# Altium project PC110.PrjPcb (part 2 of 5)

## Sheet PCMCIA.SchDoc
size 594 x 420 mm
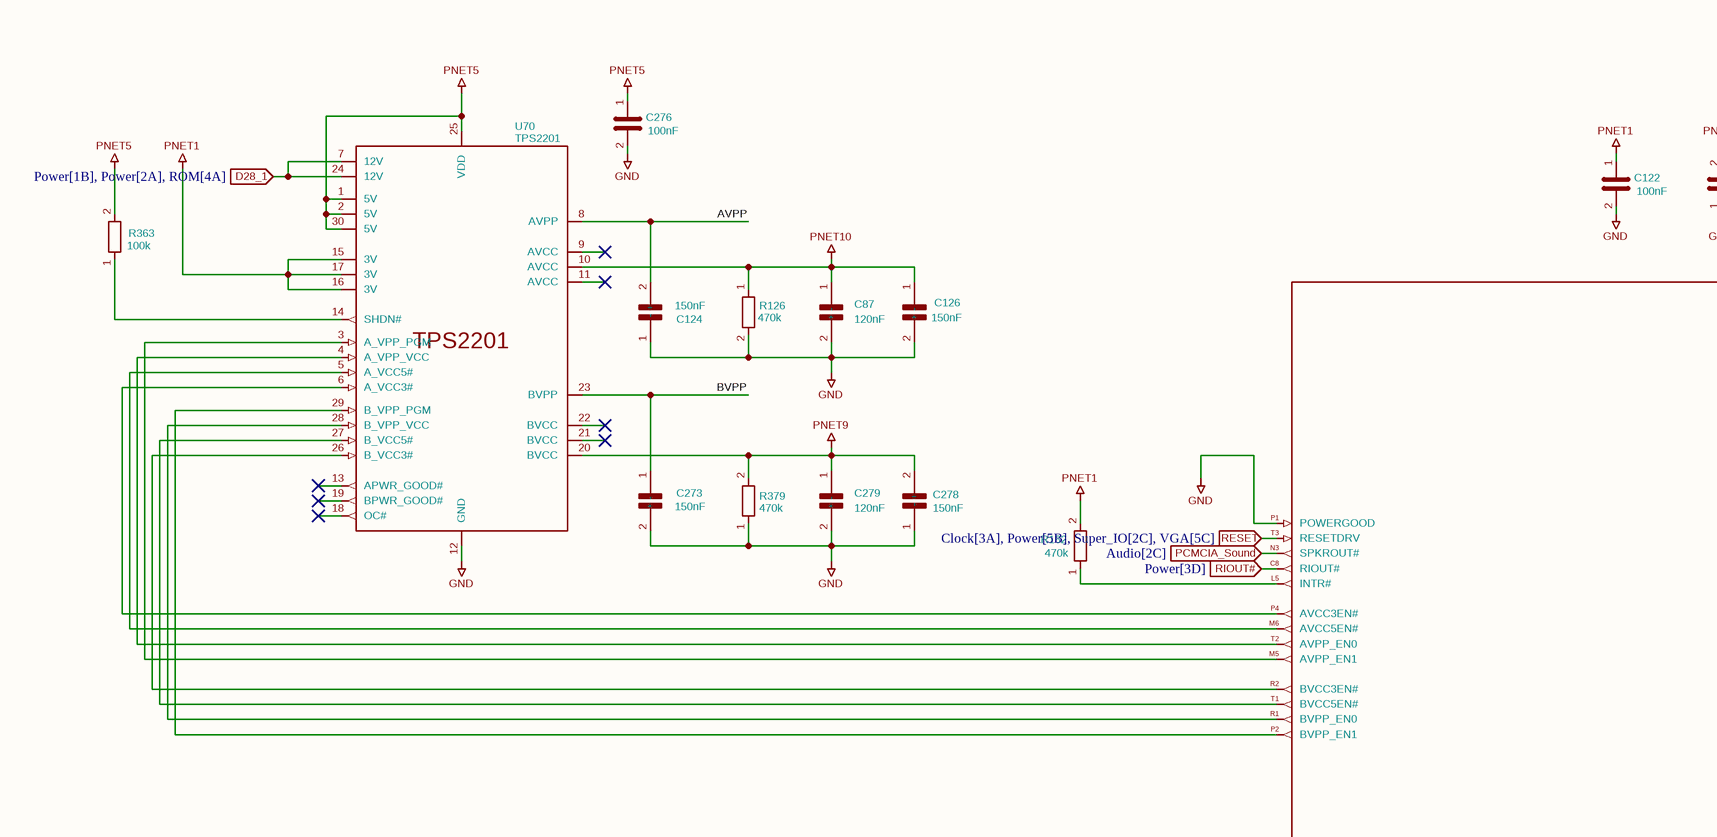
[diagram p9: PCMCIA.SchDoc, top left]
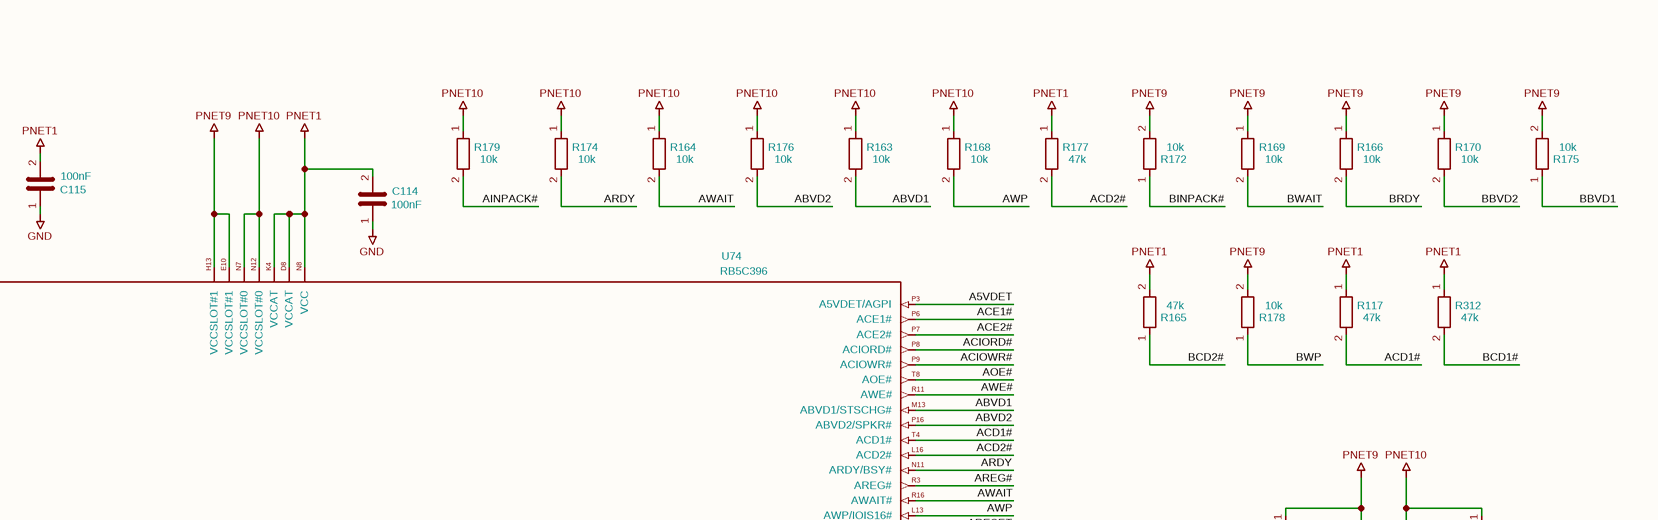
[diagram p10: PCMCIA.SchDoc, top right]
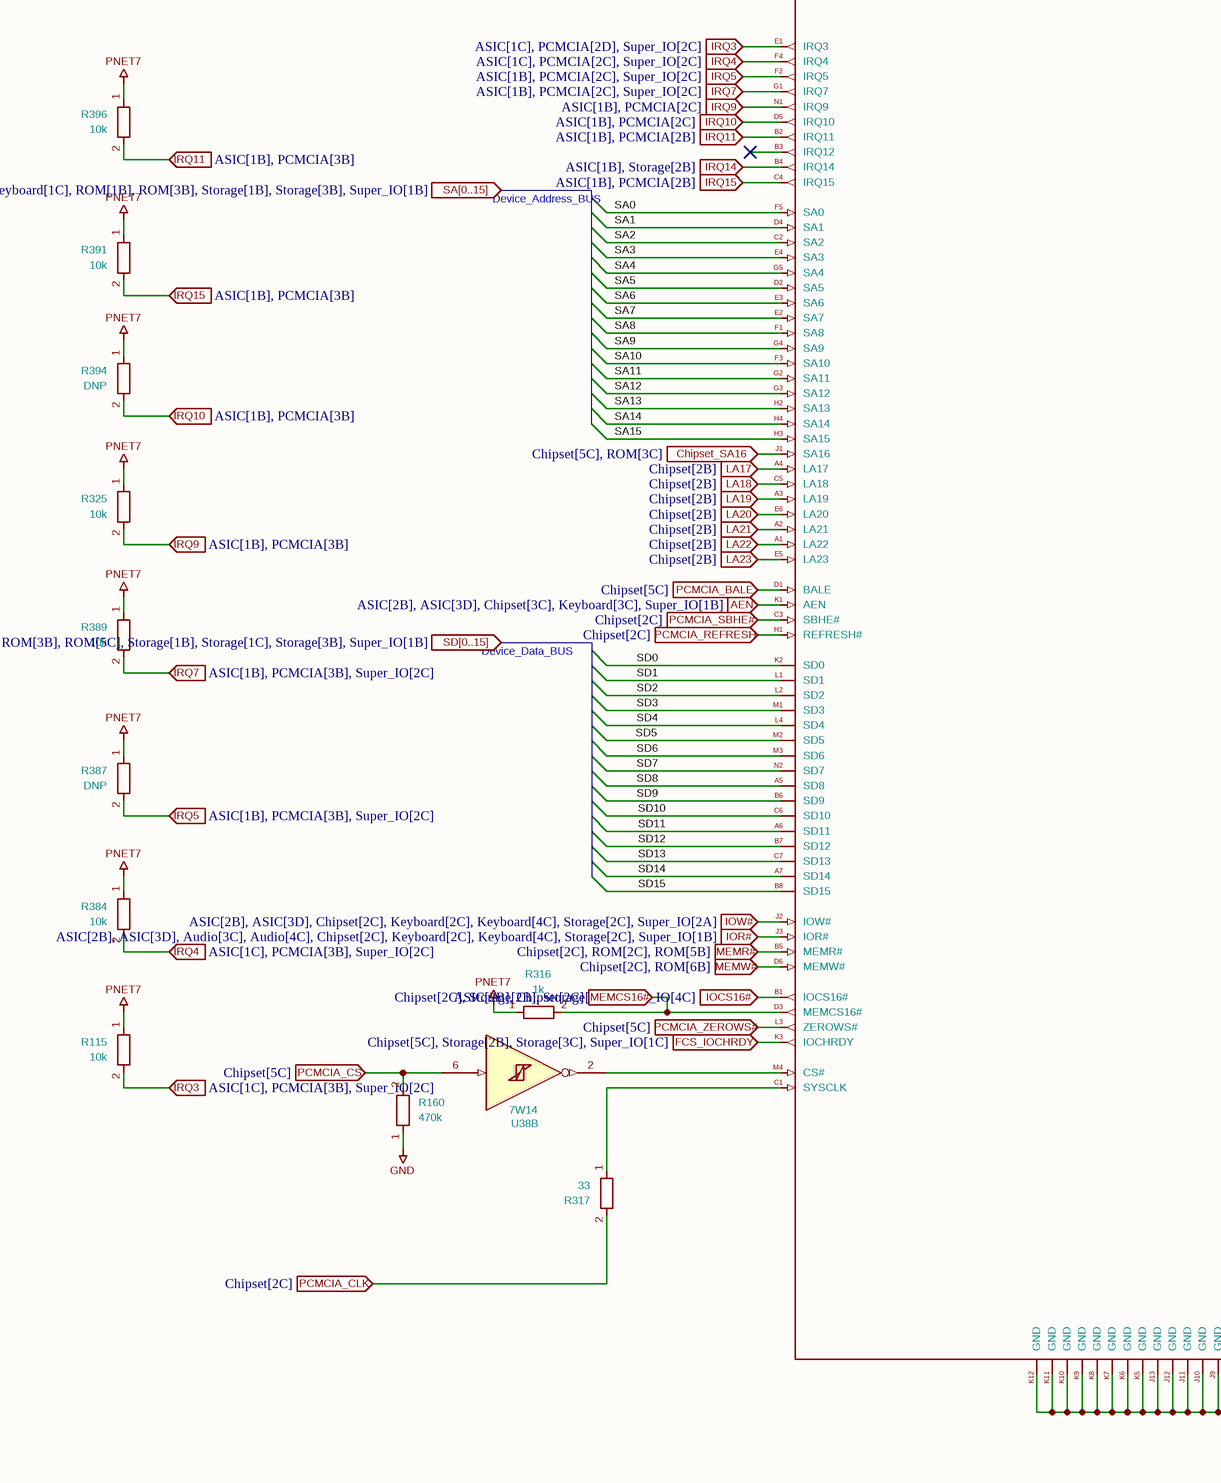
[diagram p11: PCMCIA.SchDoc, bottom left]
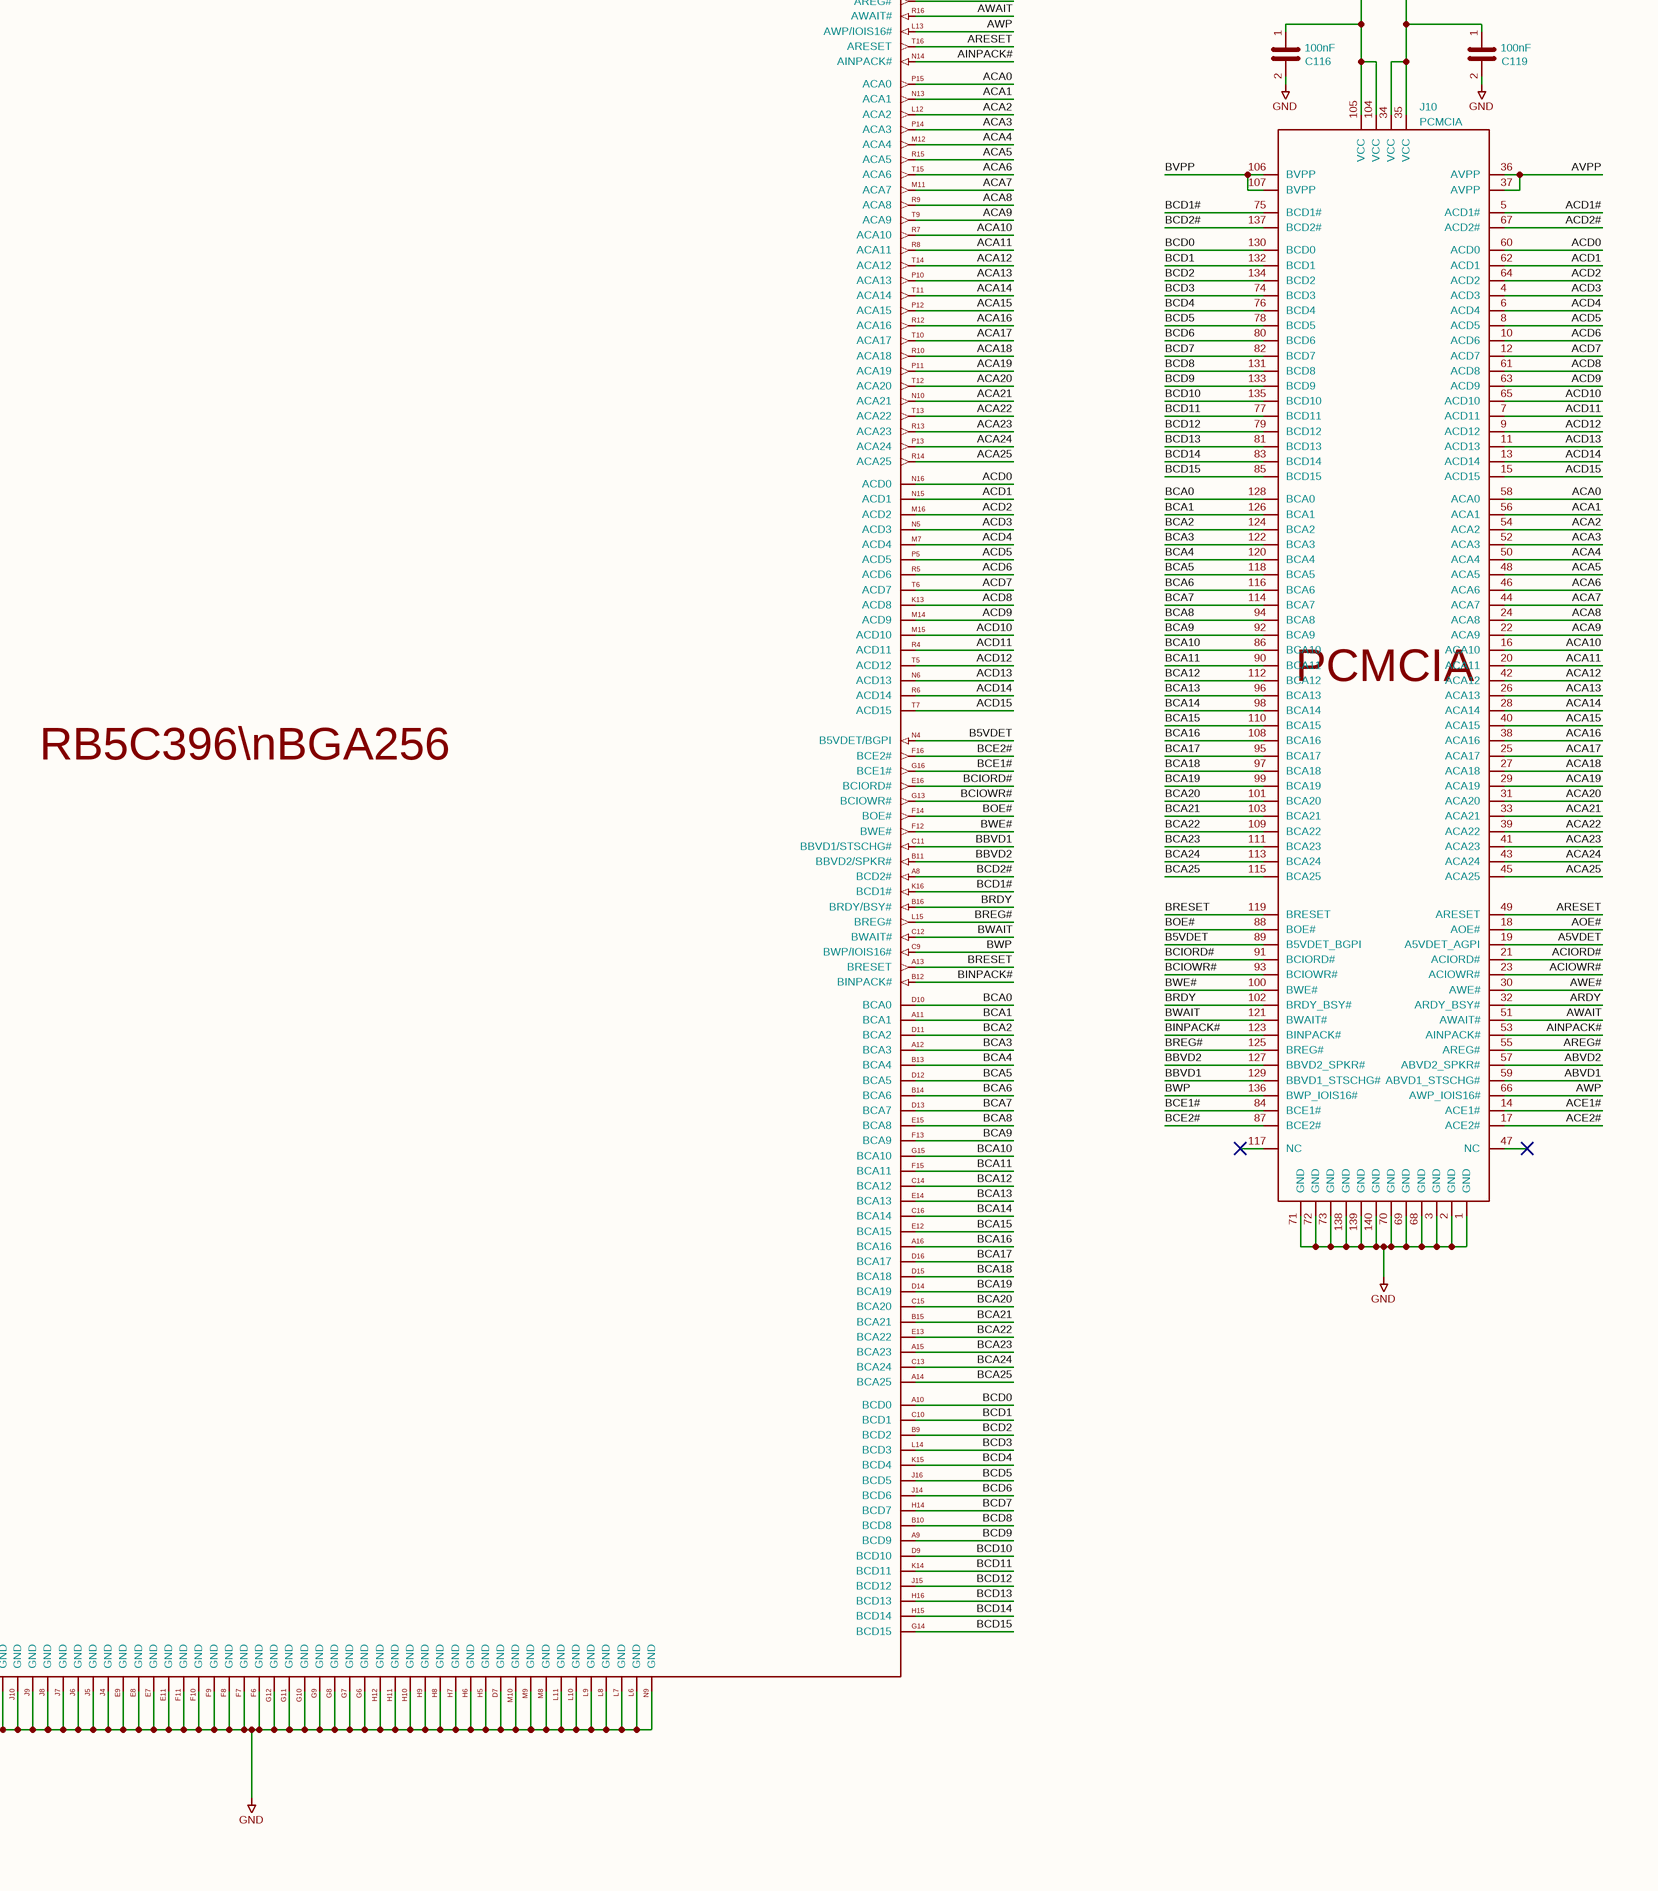
[diagram p12: PCMCIA.SchDoc, bottom right]

### Parts
C87  120nF  [C_0402_1005Metric]
C114  100nF  [C_0402_1005Metric]
C115  100nF  [C_0402_1005Metric]
C116  100nF  [C_0402_1005Metric]
C119  100nF  [C_0402_1005Metric]
C122  100nF  [C_0402_1005Metric]
C124  150nF  [C_0603_1608Metric]
C126  150nF  [C_0402_1005Metric]
C273  150nF  [C_0603_1608Metric]
C276  100nF  [C_0402_1005Metric]
C278  150nF  [C_0402_1005Metric]
C279  120nF  [C_0402_1005Metric]
J10  PCMCIA  [PCMCIA]
R115  10k  [R_0402_1005Metric]
R117  47k  [R_0402_1005Metric]
R126  470k  [R_0402_1005Metric]
R160  470k  [R_0402_1005Metric]
R162  470k  [R_0402_1005Metric]
R163  10k  [R_0402_1005Metric]
R164  10k  [R_0402_1005Metric]
R165  47k  [R_0402_1005Metric]
R166  10k  [R_0402_1005Metric]
R168  10k  [R_0402_1005Metric]
R169  10k  [R_0402_1005Metric]
R170  10k  [R_0402_1005Metric]
R172  10k  [R_0402_1005Metric]
R174  10k  [R_0402_1005Metric]
R175  10k  [R_0402_1005Metric]
R176  10k  [R_0402_1005Metric]
R177  47k  [R_0402_1005Metric]
R178  10k  [R_0402_1005Metric]
R179  10k  [R_0402_1005Metric]
R312  47k  [R_0402_1005Metric]
R316  1k  [R_0402_1005Metric]
R317  33  [R_0402_1005Metric]
R325  10k  [R_0402_1005Metric]
R363  100k  [R_0402_1005Metric]
R379  470k  [R_0402_1005Metric]
R384  10k  [R_0402_1005Metric]
R387  DNP  [R_0402_1005Metric]
R389  10k  [R_0402_1005Metric]
R391  10k  [R_0402_1005Metric]
R394  DNP  [R_0402_1005Metric]
R396  10k  [R_0402_1005Metric]
U38  7W14  [sso-8]  (part B of 4)
U70  TPS2201  [TSSOP-30_6.1x9.7mm_P0.65mm]
U74  RB5C396  [BGA-256]

### Ports
AEN (in, see ASIC[2B], ASIC[3D], Chipset[3C], Keyboard[3C], Super_IO[1B]), Chipset_SA16 (in, see Chipset[5C], ROM[3C]), D28_1 (in, see Power[1B], Power[2A], ROM[4A]), FCS_IOCHRDY (in, see Chipset[5C], Storage[2B], Storage[3C], Super_IO[1C]), IOCS16# (in, see Chipset[2C], Storage[2B], Storage[4B], Super_IO[4C]), IOR# (in, see ASIC[2B], ASIC[3D], Audio[3C], Audio[4C], Chipset[2C], Keyboard[2C], Keyboard[4C], Storage[2C], Super_IO[1B]), IOW# (in, see ASIC[2B], ASIC[3D], Chipset[2C], Keyboard[2C], Keyboard[4C], Storage[2C], Super_IO[2A]), IRQ3 (in, see ASIC[1C], PCMCIA[2D], Super_IO[2C]), IRQ3 (in, see ASIC[1C], PCMCIA[3B], Super_IO[2C]), IRQ4 (in, see ASIC[1C], PCMCIA[2C], Super_IO[2C]), IRQ4 (in, see ASIC[1C], PCMCIA[3B], Super_IO[2C]), IRQ5 (in, see ASIC[1B], PCMCIA[2C], Super_IO[2C]), IRQ5 (in, see ASIC[1B], PCMCIA[3B], Super_IO[2C]), IRQ7 (in, see ASIC[1B], PCMCIA[2C], Super_IO[2C]), IRQ7 (in, see ASIC[1B], PCMCIA[3B], Super_IO[2C]), IRQ9 (in, see ASIC[1B], PCMCIA[2C]), IRQ9 (in, see ASIC[1B], PCMCIA[3B]), IRQ10 (in, see ASIC[1B], PCMCIA[2C]), IRQ10 (in, see ASIC[1B], PCMCIA[3B]), IRQ11 (in, see ASIC[1B], PCMCIA[2B]), IRQ11 (in, see ASIC[1B], PCMCIA[3B]), IRQ14 (in, see ASIC[1B], Storage[2B]), IRQ15 (in, see ASIC[1B], PCMCIA[2B]), IRQ15 (in, see ASIC[1B], PCMCIA[3B]), LA17 (in, see Chipset[2B]), LA18 (in, see Chipset[2B]), LA19 (in, see Chipset[2B]), LA20 (in, see Chipset[2B]), LA21 (in, see Chipset[2B]), LA22 (in, see Chipset[2B]), LA23 (in, see Chipset[2B]), MEMCS16# (in, see ASIC[2B], Chipset[2C]), MEMR# (in, see Chipset[2C], ROM[2C], ROM[5B]), MEMW# (in, see Chipset[2C], ROM[6B]), PCMCIA_BALE (in, see Chipset[5C]), PCMCIA_CLK (in, see Chipset[2C]), PCMCIA_CS (in, see Chipset[5C]), PCMCIA_REFRESH (in, see Chipset[2C]), PCMCIA_SBHE# (in, see Chipset[2C]), PCMCIA_Sound (in, see Audio[2C]), PCMCIA_ZEROWS# (in, see Chipset[5C]), RESET (in, see Clock[3A], Power[5B], Super_IO[2C], VGA[5C]), RIOUT# (in, see Power[3D]), SA[0..15] (in, see ASIC[1B], ASIC[3D], Audio[4B], Chipset[2D], Chipset[6B], Keyboard[1C], ROM[1B], ROM[3B], Storage[1B], Storage[3B], Super_IO[1B]), SD[0..15] (in, see ASIC[1B], ASIC[3C], Audio[3B], Chipset[2B], Keyboard[1C], ROM[3B], ROM[5C], Storage[1B], Storage[1C], Storage[3B], Super_IO[1B])

### Nets
GND: C87.2(-) C114.1 C115.1 C116.2 C119.2 C122.2 C124.1(+) C126.2(-) C273.2(-) C276.2 C278.1(+) C279.2(-) J10.1(GND) J10.2(GND) J10.3(GND) J10.68(GND) J10.69(GND) J10.70(GND) J10.71(GND) J10.72(GND) J10.73(GND) J10.138(GND) J10.139(GND) J10.140(GND) R126.2 R160.1 R379.1 U70.12(GND) U74.D7(GND) U74.E7(GND) U74.E8(GND) U74.E9(GND) U74.E11(GND) U74.F6(GND) U74.F7(GND) U74.F8(GND) U74.F9(GND) U74.F10(GND) U74.F11(GND) U74.G6(GND) U74.G7(GND) U74.G8(GND) U74.G9(GND) U74.G10(GND) U74.G11(GND) U74.G12(GND) U74.H5(GND) U74.H6(GND) U74.H7(GND) U74.H8(GND) U74.H9(GND) U74.H10(GND) U74.H11(GND) U74.H12(GND) U74.J4(GND) U74.J5(GND) U74.J6(GND) U74.J7(GND) U74.J8(GND) U74.J9(GND) U74.J10(GND) U74.J11(GND) U74.J12(GND) U74.J13(GND) U74.K5(GND) U74.K6(GND) U74.K7(GND) U74.K8(GND) U74.K9(GND) U74.K10(GND) U74.K11(GND) U74.K12(GND) U74.L6(GND) U74.L7(GND) U74.L8(GND) U74.L9(GND) U74.L10(GND) U74.L11(GND) U74.M8(GND) U74.M9(GND) U74.M10(GND) U74.N9(GND) U74.P1(POWERGOOD)
PNET1: C114.2 C115.2 C122.1 R117.1 R162.2 R165.2 R177.1 R312.1 U70.15(3V) U70.16(3V) U70.17(3V) U74.D8(VCCAT) U74.K4(VCCAT) U74.N8(VCC)
PNET5: C276.1 R363.2 U70.1(5V) U70.2(5V) U70.25(VDD) U70.30(5V)
PNET7: R115.1 R316.1 R325.1 R384.1 R387.1 R389.1 R391.1 R394.1 R396.1
PNET9: C116.1 C278.2(-) C279.1(+) J10.104(VCC) J10.105(VCC) R166.1 R169.1 R170.1 R172.2 R175.2 R178.2 R379.2 U70.20(BVCC) U74.E10(VCCSLOT#1) U74.H13(VCCSLOT#1)
PNET10: C87.1(+) C119.1 C126.1(+) J10.34(VCC) J10.35(VCC) R126.1 R163.1 R164.1 R168.1 R174.1 R176.1 R179.1 U70.10(AVCC) U74.N7(VCCSLOT#0) U74.N12(VCCSLOT#0)
A5VDET: J10.19(A5VDET_AGPI) U74.P3(A5VDET/AGPI)
ABVD1: J10.59(ABVD1_STSCHG#) R163.2 U74.M13(ABVD1/STSCHG#)
ABVD2: J10.57(ABVD2_SPKR#) R176.2 U74.P16(ABVD2/SPKR#)
ACA0: J10.58(ACA0) U74.P15(ACA0)
ACA1: J10.56(ACA1) U74.N13(ACA1)
ACA2: J10.54(ACA2) U74.L12(ACA2)
ACA3: J10.52(ACA3) U74.P14(ACA3)
ACA4: J10.50(ACA4) U74.M12(ACA4)
ACA5: J10.48(ACA5) U74.R15(ACA5)
ACA6: J10.46(ACA6) U74.T15(ACA6)
ACA7: J10.44(ACA7) U74.M11(ACA7)
ACA8: J10.24(ACA8) U74.R9(ACA8)
ACA9: J10.22(ACA9) U74.T9(ACA9)
ACA10: J10.16(ACA10) U74.R7(ACA10)
ACA11: J10.20(ACA11) U74.R8(ACA11)
ACA12: J10.42(ACA12) U74.T14(ACA12)
ACA13: J10.26(ACA13) U74.P10(ACA13)
ACA14: J10.28(ACA14) U74.T11(ACA14)
ACA15: J10.40(ACA15) U74.P12(ACA15)
ACA16: J10.38(ACA16) U74.R12(ACA16)
ACA17: J10.25(ACA17) U74.T10(ACA17)
ACA18: J10.27(ACA18) U74.R10(ACA18)
ACA19: J10.29(ACA19) U74.P11(ACA19)
ACA20: J10.31(ACA20) U74.T12(ACA20)
ACA21: J10.33(ACA21) U74.N10(ACA21)
ACA22: J10.39(ACA22) U74.T13(ACA22)
ACA23: J10.41(ACA23) U74.R13(ACA23)
ACA24: J10.43(ACA24) U74.P13(ACA24)
ACA25: J10.45(ACA25) U74.R14(ACA25)
ACD0: J10.60(ACD0) U74.N16(ACD0)
ACD1: J10.62(ACD1) U74.N15(ACD1)
ACD1#: J10.5(ACD1#) R117.2 U74.T4(ACD1#)
ACD2: J10.64(ACD2) U74.M16(ACD2)
ACD2#: J10.67(ACD2#) R177.2 U74.L16(ACD2#)
ACD3: J10.4(ACD3) U74.N5(ACD3)
ACD4: J10.6(ACD4) U74.M7(ACD4)
ACD5: J10.8(ACD5) U74.P5(ACD5)
ACD6: J10.10(ACD6) U74.R5(ACD6)
ACD7: J10.12(ACD7) U74.T6(ACD7)
ACD8: J10.61(ACD8) U74.K13(ACD8)
ACD9: J10.63(ACD9) U74.M14(ACD9)
ACD10: J10.65(ACD10) U74.M15(ACD10)
ACD11: J10.7(ACD11) U74.R4(ACD11)
ACD12: J10.9(ACD12) U74.T5(ACD12)
ACD13: J10.11(ACD13) U74.N6(ACD13)
ACD14: J10.13(ACD14) U74.R6(ACD14)
ACD15: J10.15(ACD15) U74.T7(ACD15)
ACE1#: J10.14(ACE1#) U74.P6(ACE1#)
ACE2#: J10.17(ACE2#) U74.P7(ACE2#)
ACIORD#: J10.21(ACIORD#) U74.P8(ACIORD#)
ACIOWR#: J10.23(ACIOWR#) U74.P9(ACIOWR#)
AEN: U74.K1(AEN) ; port AEN
AINPACK#: J10.53(AINPACK#) R179.2 U74.N14(AINPACK#)
AOE#: J10.18(AOE#) U74.T8(AOE#)
ARDY: J10.32(ARDY_BSY#) R174.2 U74.N11(ARDY/BSY#)
AREG#: J10.55(AREG#) U74.R3(AREG#)
ARESET: J10.49(ARESET) U74.T16(ARESET)
AVPP: C124.2(-) J10.36(AVPP) J10.37(AVPP) U70.8(AVPP)
AWAIT: J10.51(AWAIT#) R164.2 U74.R16(AWAIT#)
AWE#: J10.30(AWE#) U74.R11(AWE#)
AWP: J10.66(AWP_IOIS16#) R168.2 U74.L13(AWP/IOIS16#)
B5VDET: J10.89(B5VDET_BGPI) U74.N4(B5VDET/BGPI)
BBVD1: J10.129(BBVD1_STSCHG#) R175.1 U74.C11(BBVD1/STSCHG#)
BBVD2: J10.127(BBVD2_SPKR#) R170.2 U74.B11(BBVD2/SPKR#)
BCA0: J10.128(BCA0) U74.D10(BCA0)
BCA1: J10.126(BCA1) U74.A11(BCA1)
BCA2: J10.124(BCA2) U74.D11(BCA2)
BCA3: J10.122(BCA3) U74.A12(BCA3)
BCA4: J10.120(BCA4) U74.B13(BCA4)
BCA5: J10.118(BCA5) U74.D12(BCA5)
BCA6: J10.116(BCA6) U74.B14(BCA6)
BCA7: J10.114(BCA7) U74.D13(BCA7)
BCA8: J10.94(BCA8) U74.E15(BCA8)
BCA9: J10.92(BCA9) U74.F13(BCA9)
BCA10: J10.86(BCA10) U74.G15(BCA10)
BCA11: J10.90(BCA11) U74.F15(BCA11)
BCA12: J10.112(BCA12) U74.C14(BCA12)
BCA13: J10.96(BCA13) U74.E14(BCA13)
BCA14: J10.98(BCA14) U74.C16(BCA14)
BCA15: J10.110(BCA15) U74.E12(BCA15)
BCA16: J10.108(BCA16) U74.A16(BCA16)
BCA17: J10.95(BCA17) U74.D16(BCA17)
BCA18: J10.97(BCA18) U74.D15(BCA18)
BCA19: J10.99(BCA19) U74.D14(BCA19)
BCA20: J10.101(BCA20) U74.C15(BCA20)
BCA21: J10.103(BCA21) U74.B15(BCA21)
BCA22: J10.109(BCA22) U74.E13(BCA22)
BCA23: J10.111(BCA23) U74.A15(BCA23)
BCA24: J10.113(BCA24) U74.C13(BCA24)
BCA25: J10.115(BCA25) U74.A14(BCA25)
BCD0: J10.130(BCD0) U74.A10(BCD0)
BCD1: J10.132(BCD1) U74.C10(BCD1)
BCD1#: J10.75(BCD1#) R312.2 U74.K16(BCD1#)
BCD2: J10.134(BCD2) U74.B9(BCD2)
BCD2#: J10.137(BCD2#) R165.1 U74.A8(BCD2#)
BCD3: J10.74(BCD3) U74.L14(BCD3)
BCD4: J10.76(BCD4) U74.K15(BCD4)
BCD5: J10.78(BCD5) U74.J16(BCD5)
BCD6: J10.80(BCD6) U74.J14(BCD6)
BCD7: J10.82(BCD7) U74.H14(BCD7)
BCD8: J10.131(BCD8) U74.B10(BCD8)
BCD9: J10.133(BCD9) U74.A9(BCD9)
BCD10: J10.135(BCD10) U74.D9(BCD10)
BCD11: J10.77(BCD11) U74.K14(BCD11)
BCD12: J10.79(BCD12) U74.J15(BCD12)
BCD13: J10.81(BCD13) U74.H16(BCD13)
BCD14: J10.83(BCD14) U74.H15(BCD14)
BCD15: J10.85(BCD15) U74.G14(BCD15)
BCE1#: J10.84(BCE1#) U74.G16(BCE1#)
BCE2#: J10.87(BCE2#) U74.F16(BCE2#)
BCIORD#: J10.91(BCIORD#) U74.E16(BCIORD#)
BCIOWR#: J10.93(BCIOWR#) U74.G13(BCIOWR#)
BINPACK#: J10.123(BINPACK#) R172.1 U74.B12(BINPACK#)
BOE#: J10.88(BOE#) U74.F14(BOE#)
BRDY: J10.102(BRDY_BSY#) R166.2 U74.B16(BRDY/BSY#)
BREG#: J10.125(BREG#) U74.L15(BREG#)
BRESET: J10.119(BRESET) U74.A13(BRESET)
BVPP: C273.1(+) J10.106(BVPP) J10.107(BVPP) U70.23(BVPP)
BWAIT: J10.121(BWAIT#) R169.2 U74.C12(BWAIT#)
BWE#: J10.100(BWE#) U74.F12(BWE#)
BWP: J10.136(BWP_IOIS16#) R178.1 U74.C9(BWP/IOIS16#)
Chipset_SA16: U74.J1(SA16) ; port Chipset_SA16
D28_1: U70.7(12V) U70.24(12V) ; port D28_1
FCS_IOCHRDY: U74.K3(IOCHRDY) ; port FCS_IOCHRDY
IOCS16#: U74.B1(IOCS16#) ; port IOCS16#
IOR#: U74.J3(IOR#) ; port IOR#
IOW#: U74.J2(IOW#) ; port IOW#
IRQ3: R115.2 U74.E1(IRQ3) ; port IRQ3
IRQ4: R384.2 U74.F4(IRQ4) ; port IRQ4
IRQ5: R387.2 U74.F2(IRQ5) ; port IRQ5
IRQ7: R389.2 U74.G1(IRQ7) ; port IRQ7
IRQ9: R325.2 U74.N1(IRQ9) ; port IRQ9
IRQ10: R394.2 U74.D5(IRQ10) ; port IRQ10
IRQ11: R396.2 U74.B2(IRQ11) ; port IRQ11
IRQ14: U74.B4(IRQ14) ; port IRQ14
IRQ15: R391.2 U74.C4(IRQ15) ; port IRQ15
LA17: U74.A4(LA17) ; port LA17
LA18: U74.C5(LA18) ; port LA18
LA19: U74.A3(LA19) ; port LA19
LA20: U74.E6(LA20) ; port LA20
LA21: U74.A2(LA21) ; port LA21
LA22: U74.A1(LA22) ; port LA22
LA23: U74.E5(LA23) ; port LA23
MEMCS16#: R316.2 U74.D3(MEMCS16#) ; port MEMCS16#
MEMR#: U74.B5(MEMR#) ; port MEMR#
MEMW#: U74.D6(MEMW#) ; port MEMW#
PCMCIA_BALE: U74.D1(BALE) ; port PCMCIA_BALE
PCMCIA_CLK: R317.2 ; port PCMCIA_CLK
PCMCIA_CS: R160.2 U38.6 ; port PCMCIA_CS
PCMCIA_REFRESH: U74.H1(REFRESH#) ; port PCMCIA_REFRESH
PCMCIA_SBHE#: U74.C3(SBHE#) ; port PCMCIA_SBHE#
PCMCIA_Sound: U74.N3(SPKROUT#) ; port PCMCIA_Sound
PCMCIA_ZEROWS#: U74.L3(ZEROWS#) ; port PCMCIA_ZEROWS#
RESET: U74.T3(RESETDRV) ; port RESET
RIOUT#: U74.C8(RIOUT#) ; port RIOUT#
SA0: U74.F5(SA0)
SA1: U74.D4(SA1)
SA2: U74.C2(SA2)
SA3: U74.E4(SA3)
SA4: U74.G5(SA4)
SA5: U74.D2(SA5)
SA6: U74.E3(SA6)
SA7: U74.E2(SA7)
SA8: U74.F1(SA8)
SA9: U74.G4(SA9)
SA10: U74.F3(SA10)
SA11: U74.G2(SA11)
SA12: U74.G3(SA12)
SA13: U74.H2(SA13)
SA14: U74.H4(SA14)
SA15: U74.H3(SA15)
SD0: U74.K2(SD0)
SD1: U74.L1(SD1)
SD2: U74.L2(SD2)
SD3: U74.M1(SD3)
SD4: U74.L4(SD4)
SD5: U74.M2(SD5)
SD6: U74.M3(SD6)
SD7: U74.N2(SD7)
SD8: U74.A5(SD8)
SD9: U74.B6(SD9)
SD10: U74.C6(SD10)
SD11: U74.A6(SD11)
SD12: U74.B7(SD12)
SD13: U74.C7(SD13)
SD14: U74.A7(SD14)
SD15: U74.B8(SD15)
NetR162_1: R162.1 U74.L5(INTR#)
NetR317_1: R317.1 U74.C1(SYSCLK)
NetR363_1: R363.1 U70.14(SHDN#)
NetU38_2: U38.2 U74.M4(CS#)
NetU70_3: U70.3(A_VPP_PGM) U74.M5(AVPP_EN1)
NetU70_4: U70.4(A_VPP_VCC) U74.T2(AVPP_EN0)
NetU70_5: U70.5(A_VCC5#) U74.M6(AVCC5EN#)
NetU70_6: U70.6(A_VCC3#) U74.P4(AVCC3EN#)
NetU70_26: U70.26(B_VCC3#) U74.R2(BVCC3EN#)
NetU70_27: U70.27(B_VCC5#) U74.T1(BVCC5EN#)
NetU70_28: U70.28(B_VPP_VCC) U74.R1(BVPP_EN0)
NetU70_29: U70.29(B_VPP_PGM) U74.P2(BVPP_EN1)

Not connected (* = marked no-connect by the designer): J10 47(NC)* 117(NC)*; U70 9(AVCC)* 11(AVCC)* 13(APWR_GOOD#)* 18(OC#)* 19(BPWR_GOOD#)* 21(BVCC)* 22(BVCC)*; U74 B3(IRQ12)*

### Notes on the sheet
- Device_Address_BUS
- Device_Data_BUS
- 1
- 2
- 3
- 4
- 5
- 6
- 7
- 8
- 9
- 10
- 11
- A
- B
- C
- D
- E
- F
- G
- H
- Title: PC110
- File: PCMCIA.kicad_sch
- Sheet: /
- Recreated by: Ahmad Byagowi
- KiCad E.D.A.  kicad (5.1.4)-1
- Size: A2
- Date:
- Rev:
- Id: 1/1
- (in symbol RB5C396) RB5C396\nBGA256

### Library data of the parts
C87 C114-C116 C119 C122 C124 C126 C273 C276 C278 C279 = C
  C87 C279: Value: 120nF; Footprint: Capacitor_SMD:C_0402_1005Metric
  C114-C116 C119 C122 C276: Value: 100nF; Footprint: Capacitor_SMD:C_0402_1005Metric
  C124 C273: Value: 150nF; Footprint: Capacitor_SMD:C_0603_1608Metric
  C126 C278: Value: 150nF; Footprint: Capacitor_SMD:C_0402_1005Metric
J10 = PCMCIA_Conn: Value: PCMCIA; Footprint: PC110:PCMCIA
R115 R117 R126 R160 R162-R166 R168-R170 R172 R174-R179 R312 R316 R317 R325 R363 R379 R384 R387 R389 R391 R394 R396 = R
  R115 R163 R164 R166 R168-R170 R172 R174-R176 R178 R179: Value: 10k; Footprint: PCM_Resistor_SMD_AKL:R_0402_1005Metric
  R117 R165 R177: Value: 47k; Footprint: PCM_Resistor_SMD_AKL:R_0402_1005Metric
  R126 R160 R162: Value: 470k; Footprint: PCM_Resistor_SMD_AKL:R_0402_1005Metric
  R312: Value: 47k; Footprint: Resistor_SMD:R_0402_1005Metric
  R316: Value: 1k; Footprint: PCM_Resistor_SMD_AKL:R_0402_1005Metric
  R317: Value: 33; Footprint: PCM_Resistor_SMD_AKL:R_0402_1005Metric
  R325 R384 R389 R391 R396: Value: 10k; Footprint: Resistor_SMD:R_0402_1005Metric
  R363: Value: 100k; Footprint: Resistor_SMD:R_0402_1005Metric
  R379: Value: 470k; Footprint: Resistor_SMD:R_0402_1005Metric
  R387 R394: Value: DNP; Footprint: Resistor_SMD:R_0402_1005Metric
U38 = 74LVC3G14: Value: 7W14; Footprint: PC110:sso-8
U70 = TPS2201: Value: TPS2201; Footprint: Package_SO:TSSOP-30_6.1x9.7mm_P0.65mm
U74 = RB5C396: Value: RB5C396; Footprint: PC110:BGA-256

## Sheet Memory.SchDoc
size 420 x 297 mm
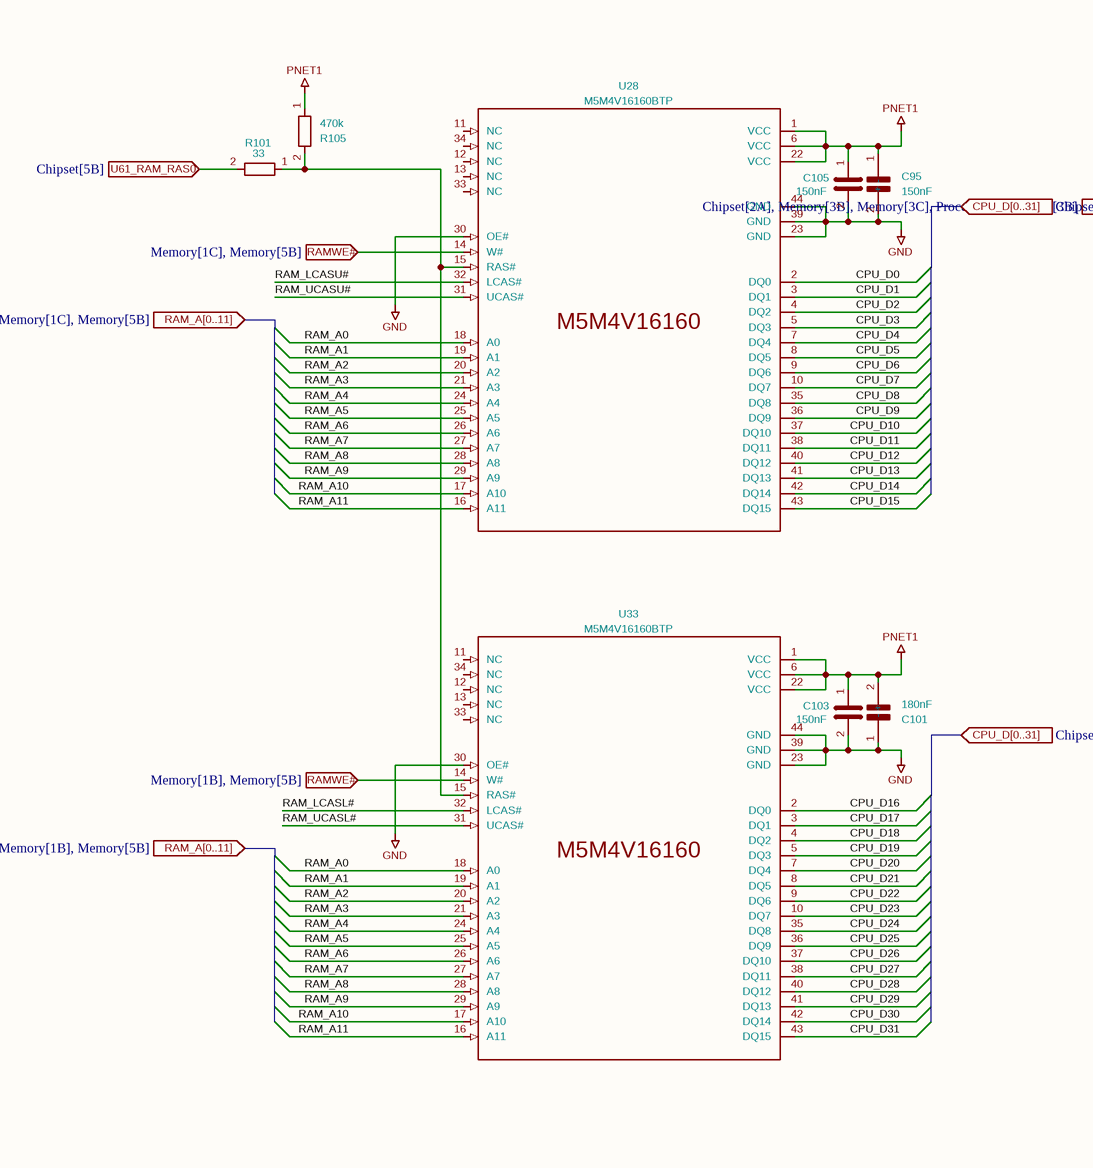
[diagram p13: Memory.SchDoc, left]
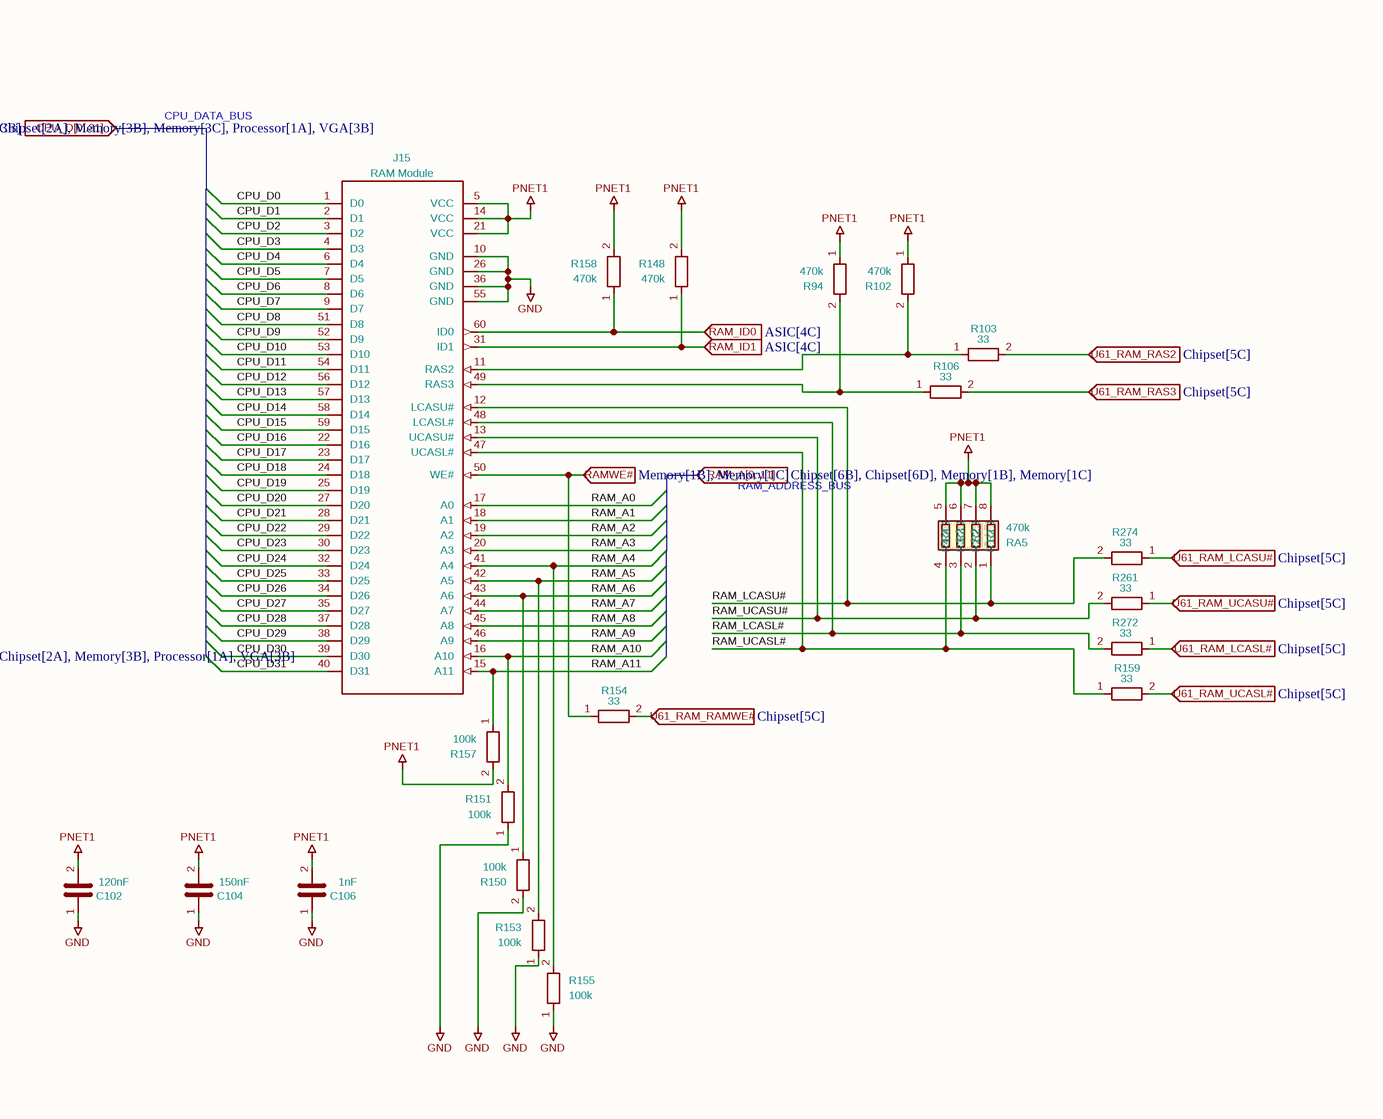
[diagram p14: Memory.SchDoc, right]

### Parts
C95  150nF  [C_0402_1005Metric]
C101  180nF  [C_0402_1005Metric]
C102  120nF  [C_0402_1005Metric]
C103  150nF  [C_0402_1005Metric]
C104  150nF  [C_0402_1005Metric]
C105  150nF  [C_0402_1005Metric]
C106  1nF  [C_0402_1005Metric]
J15  RAM Module  [RAM Module]
R94  470k  [R_0402_1005Metric]
R101  33  [R_0402_1005Metric]
R102  470k  [R_0402_1005Metric]
R103  33  [R_0402_1005Metric]
R105  470k  [R_0402_1005Metric]
R106  33  [R_0402_1005Metric]
R148  470k  [R_0402_1005Metric]
R150  100k  [R_0402_1005Metric]
R151  100k  [R_0402_1005Metric]
R153  100k  [R_0402_1005Metric]
R154  33  [R_0402_1005Metric]
R155  100k  [R_0402_1005Metric]
R157  100k  [R_0402_1005Metric]
R158  470k  [R_0402_1005Metric]
R159  33  [R_0402_1005Metric]
R261  33  [R_0402_1005Metric]
R272  33  [R_0402_1005Metric]
R274  33  [R_0402_1005Metric]
RA5  470k  [R-array]
U28  M5M4V16160BTP  [RAMchip]
U33  M5M4V16160BTP  [RAMchip]

### Ports
CPU_D[0..31] (in, see Chipset[2A], Memory[3B], Memory[3C], Processor[1A], VGA[3B]), CPU_D[0..31] (in, see Chipset[2A], Memory[3B], Processor[1A], VGA[3B]), RAM_A[0..11] (in, see Chipset[6B], Chipset[6D], Memory[1B], Memory[1C]), RAM_A[0..11] (in, see Chipset[6B], Chipset[6D], Memory[1B], Memory[5B]), RAM_A[0..11] (in, see Chipset[6B], Chipset[6D], Memory[1C], Memory[5B]), RAM_ID0 (in, see ASIC[4C]), RAM_ID1 (in, see ASIC[4C]), RAMWE# (in, see Memory[1B], Memory[1C]), RAMWE# (in, see Memory[1B], Memory[5B]), RAMWE# (in, see Memory[1C], Memory[5B]), U61_RAM_LCASL# (in, see Chipset[5C]), U61_RAM_LCASU# (in, see Chipset[5C]), U61_RAM_RAMWE# (in, see Chipset[5C]), U61_RAM_RAS0 (in, see Chipset[5B]), U61_RAM_RAS2 (in, see Chipset[5C]), U61_RAM_RAS3 (in, see Chipset[5C]), U61_RAM_UCASL# (in, see Chipset[5C]), U61_RAM_UCASU# (in, see Chipset[5C])

### Nets
GND: C95.2(-) C101.1(+) C102.1 C103.2 C104.1 C105.2 C106.1 J15.10(GND) J15.26(GND) J15.36(GND) J15.55(GND) R150.2 R151.1 R153.1 R155.1 U28.23(GND) U28.30(OE#) U28.39(GND) U28.44(GND) U33.23(GND) U33.30(OE#) U33.39(GND) U33.44(GND)
PNET1: C95.1(+) C101.2(-) C102.2 C103.1 C104.2 C105.1 C106.2 J15.5(VCC) J15.14(VCC) J15.21(VCC) R94.1 R102.1 R105.1 R148.2 R157.2 R158.2 RA5.5(R4.2) RA5.6(R3.2) RA5.7(R2.2) RA5.8(R1.2) U28.1(VCC) U28.6(VCC) U28.22(VCC) U33.1(VCC) U33.6(VCC) U33.22(VCC)
CPU_D0: J15.1(D0) U28.2(DQ0)
CPU_D1: J15.2(D1) U28.3(DQ1)
CPU_D2: J15.3(D2) U28.4(DQ2)
CPU_D3: J15.4(D3) U28.5(DQ3)
CPU_D4: J15.6(D4) U28.7(DQ4)
CPU_D5: J15.7(D5) U28.8(DQ5)
CPU_D6: J15.8(D6) U28.9(DQ6)
CPU_D7: J15.9(D7) U28.10(DQ7)
CPU_D8: J15.51(D8) U28.35(DQ8)
CPU_D9: J15.52(D9) U28.36(DQ9)
CPU_D10: J15.53(D10) U28.37(DQ10)
CPU_D11: J15.54(D11) U28.38(DQ11)
CPU_D12: J15.56(D12) U28.40(DQ12)
CPU_D13: J15.57(D13) U28.41(DQ13)
CPU_D14: J15.58(D14) U28.42(DQ14)
CPU_D15: J15.59(D15) U28.43(DQ15)
CPU_D16: J15.22(D16) U33.2(DQ0)
CPU_D17: J15.23(D17) U33.3(DQ1)
CPU_D18: J15.24(D18) U33.4(DQ2)
CPU_D19: J15.25(D19) U33.5(DQ3)
CPU_D20: J15.27(D20) U33.7(DQ4)
CPU_D21: J15.28(D21) U33.8(DQ5)
CPU_D22: J15.29(D22) U33.9(DQ6)
CPU_D23: J15.30(D23) U33.10(DQ7)
CPU_D24: J15.32(D24) U33.35(DQ8)
CPU_D25: J15.33(D25) U33.36(DQ9)
CPU_D26: J15.34(D26) U33.37(DQ10)
CPU_D27: J15.35(D27) U33.38(DQ11)
CPU_D28: J15.37(D28) U33.40(DQ12)
CPU_D29: J15.38(D29) U33.41(DQ13)
CPU_D30: J15.39(D30) U33.42(DQ14)
CPU_D31: J15.40(D31) U33.43(DQ15)
RAM_A0: J15.17(A0) U28.18(A0) U33.18(A0)
RAM_A1: J15.18(A1) U28.19(A1) U33.19(A1)
RAM_A2: J15.19(A2) U28.20(A2) U33.20(A2)
RAM_A3: J15.20(A3) U28.21(A3) U33.21(A3)
RAM_A4: J15.41(A4) R155.2 U28.24(A4) U33.24(A4)
RAM_A5: J15.42(A5) R153.2 U28.25(A5) U33.25(A5)
RAM_A6: J15.43(A6) R150.1 U28.26(A6) U33.26(A6)
RAM_A7: J15.44(A7) U28.27(A7) U33.27(A7)
RAM_A8: J15.45(A8) U28.28(A8) U33.28(A8)
RAM_A9: J15.46(A9) U28.29(A9) U33.29(A9)
RAM_A10: J15.16(A10) R151.2 U28.17(A10) U33.17(A10)
RAM_A11: J15.15(A11) R157.1 U28.16(A11) U33.16(A11)
RAM_ID0: J15.60(ID0) R158.1 ; port RAM_ID0
RAM_ID1: J15.31(ID1) R148.1 ; port RAM_ID1
RAM_LCASL#: J15.48(LCASL#) R272.2 RA5.3(R3.1) U33.32(LCAS#)
RAM_LCASU#: J15.12(LCASU#) R274.2 RA5.1(R1.1) U28.32(LCAS#)
RAM_UCASL#: J15.47(UCASL#) R159.1 RA5.4(R4.1) U33.31(UCAS#)
RAM_UCASU#: J15.13(UCASU#) R261.2 RA5.2(R2.1) U28.31(UCAS#)
RAMWE#: J15.50(WE#) R154.1 U28.14(W#) U33.14(W#) ; port RAMWE#
U61_RAM_LCASL#: R272.1 ; port U61_RAM_LCASL#
U61_RAM_LCASU#: R274.1 ; port U61_RAM_LCASU#
U61_RAM_RAMWE#: R154.2 ; port U61_RAM_RAMWE#
U61_RAM_RAS0: R101.2 ; port U61_RAM_RAS0
U61_RAM_RAS2: R103.2 ; port U61_RAM_RAS2
U61_RAM_RAS3: R106.2 ; port U61_RAM_RAS3
U61_RAM_UCASL#: R159.2 ; port U61_RAM_UCASL#
U61_RAM_UCASU#: R261.1 ; port U61_RAM_UCASU#
NetJ15_11: J15.11(RAS2) R102.2 R103.1
NetJ15_49: J15.49(RAS3) R94.2 R106.1
NetR101_1: R101.1 R105.2 U28.15(RAS#) U33.15(RAS#)

Not connected (* = marked no-connect by the designer): U28 11(NC) 12(NC) 13(NC) 33(NC) 34(NC); U33 11(NC) 12(NC) 13(NC) 33(NC) 34(NC)

### Notes on the sheet
- CPU_DATA_BUS
- RAM_ADDRESS_BUS
- 1
- 2
- 3
- 4
- 5
- 6
- 7
- 8
- A
- B
- C
- D
- E
- Title: PC110
- File: Memory.kicad_sch
- Sheet: /
- Recreated by: Ahmad Byagowi
- F
- KiCad E.D.A.  kicad (5.1.4)-1
- Size: A3
- Date:
- Rev:
- Id: 1/1

### Library data of the parts
C95 C101-C106 = C: Footprint: Capacitor_SMD:C_0402_1005Metric
  C95 C103-C105: Value: 150nF
  C101: Value: 180nF
  C102: Value: 120nF
  C106: Value: 1nF
J15 = RAM_MOD: Value: RAM Module; Footprint: PC110:RAM Module
R94 R101-R103 R105 R106 R148 R150 R151 R153-R155 R157-R159 R261 R272 R274 = R: Footprint: PCM_Resistor_SMD_AKL:R_0402_1005Metric
  R94 R102 R105 R148 R158: Value: 470k
  R101 R103 R106 R154 R159 R261 R272 R274: Value: 33
  R150 R151 R153 R155 R157: Value: 100k
RA5 = R_Pack04: Value: 470k; Footprint: PC110:R-array
U28 U33 = M5M4V16160: Value: M5M4V16160BTP; Footprint: PC110:RAMchip

## Sheet Chipset.SchDoc
size 594 x 420 mm
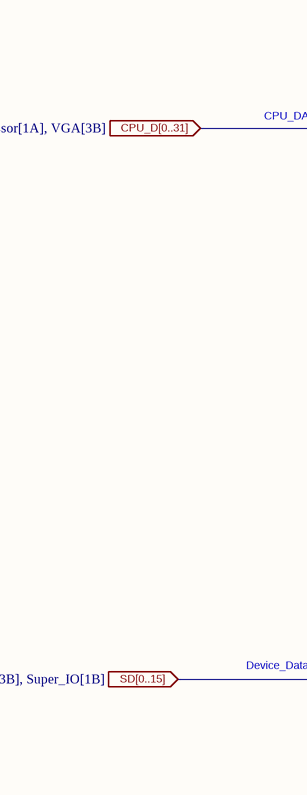
[diagram p15: Chipset.SchDoc, top left]
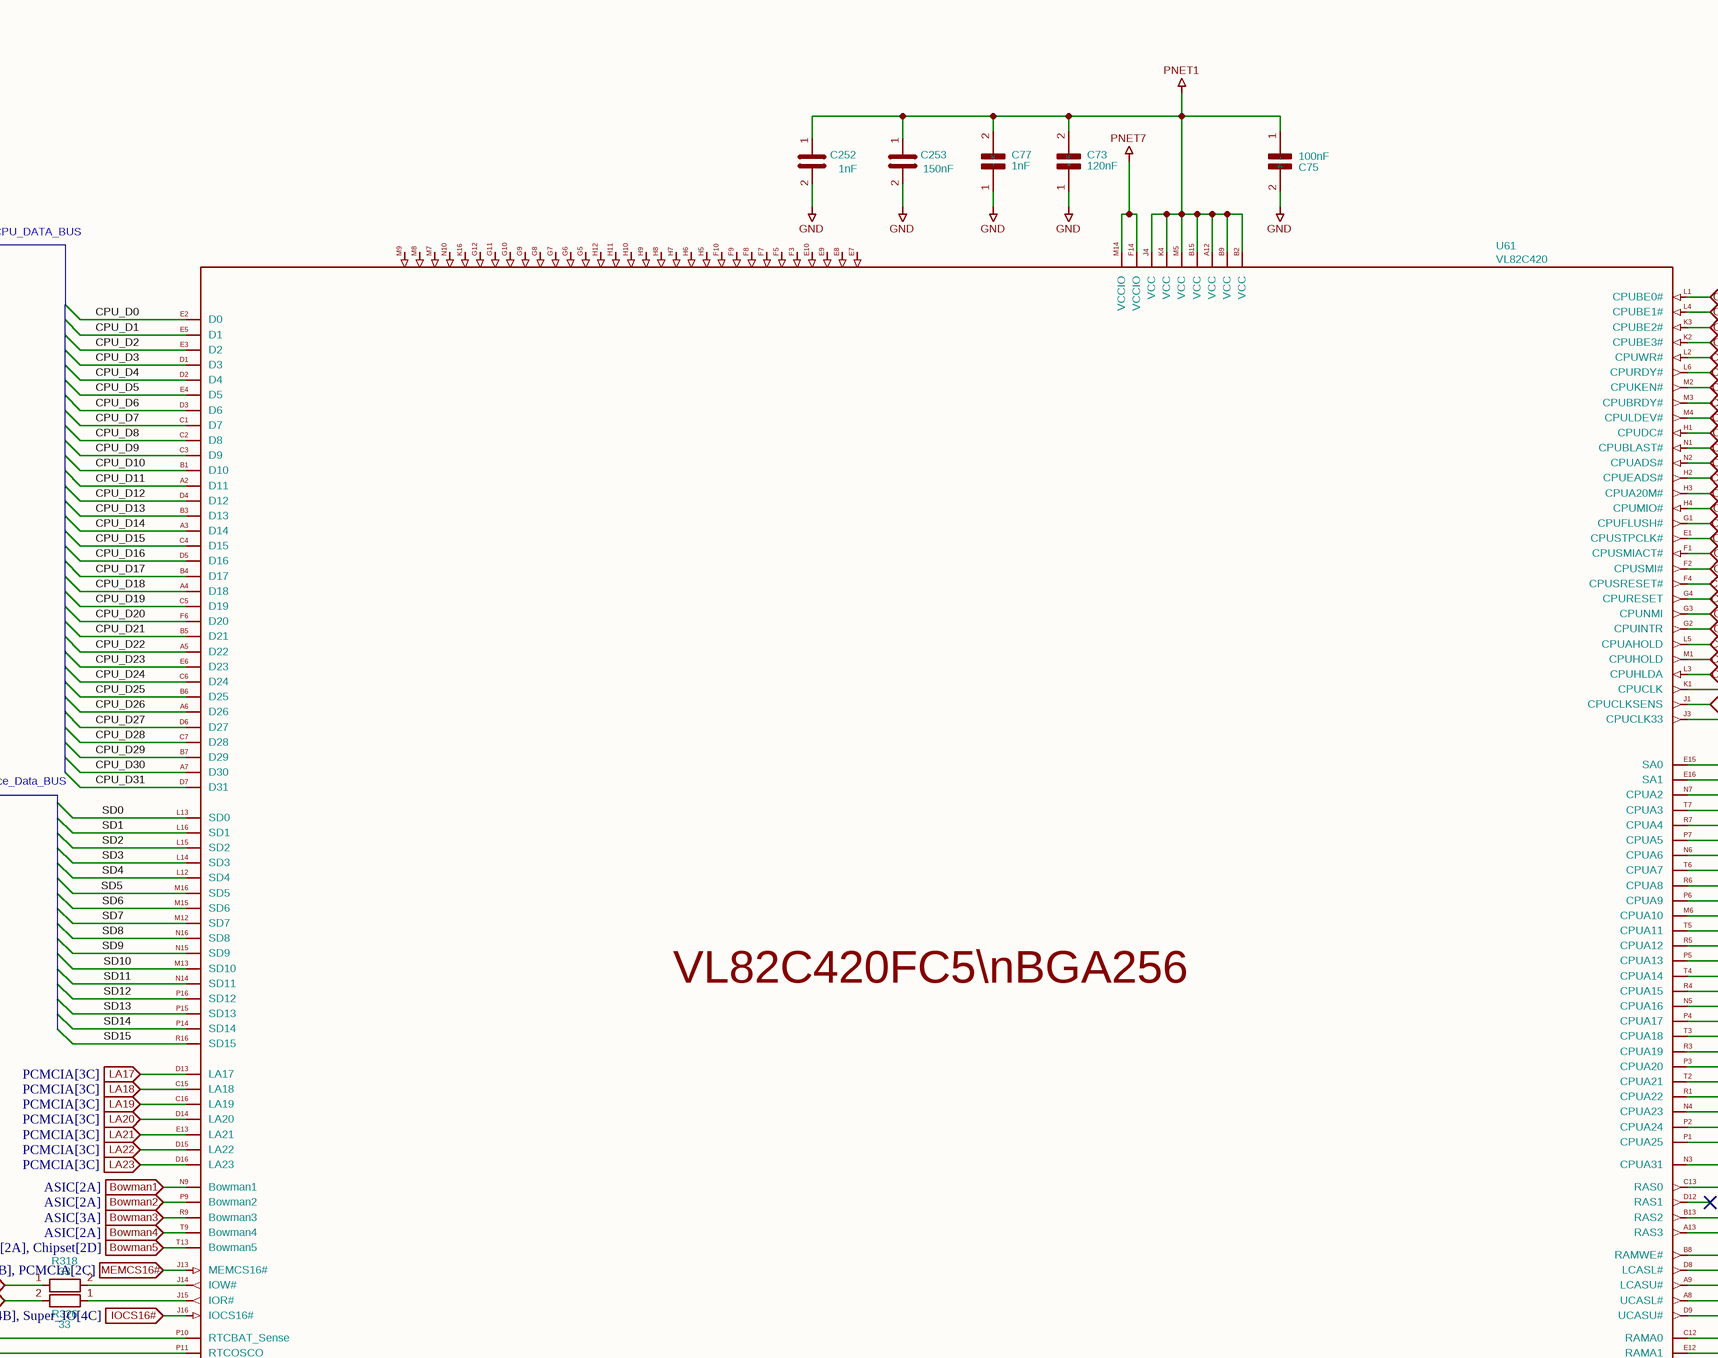
[diagram p16: Chipset.SchDoc, top middle]
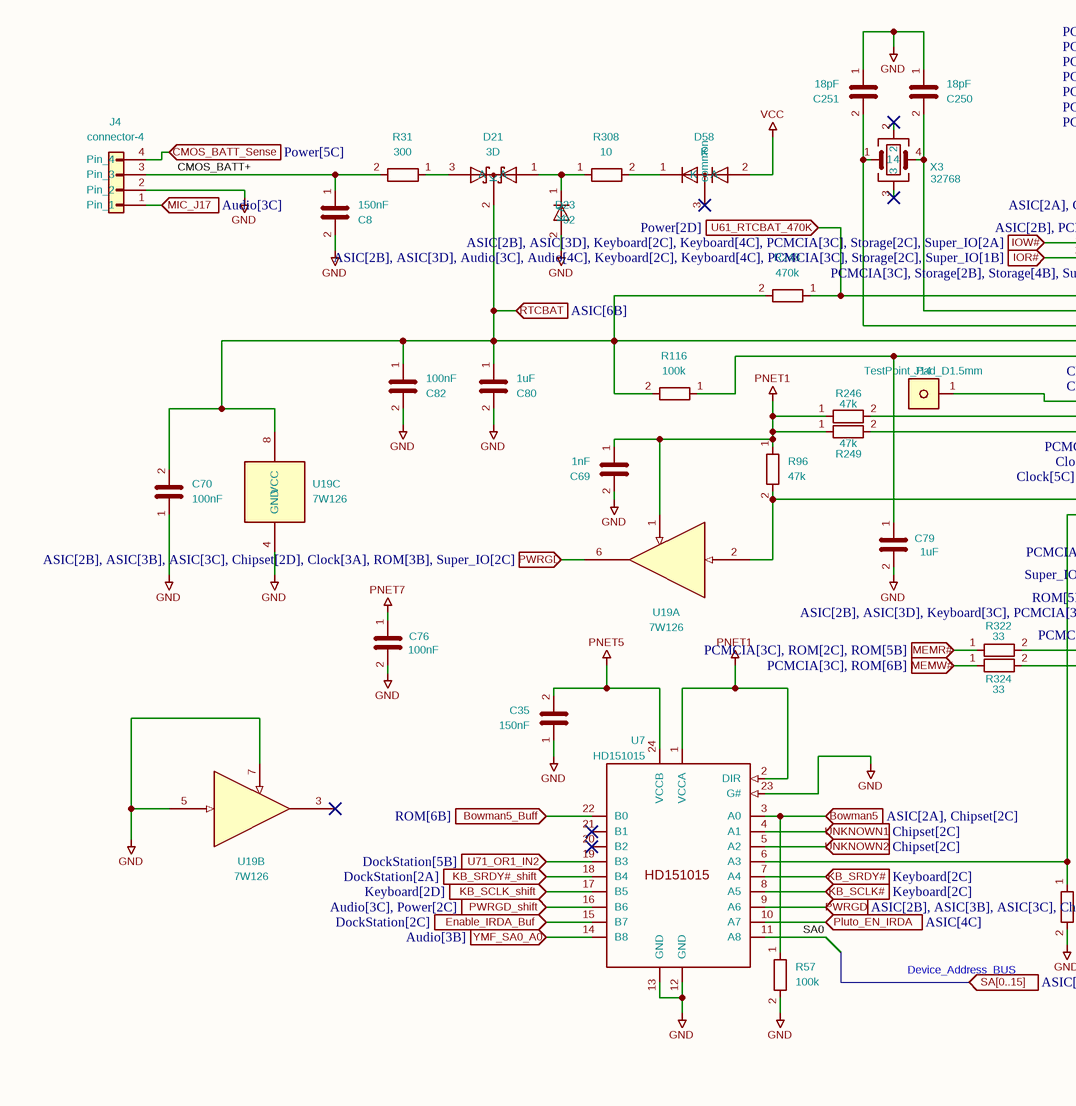
[diagram p17: Chipset.SchDoc, bottom left]
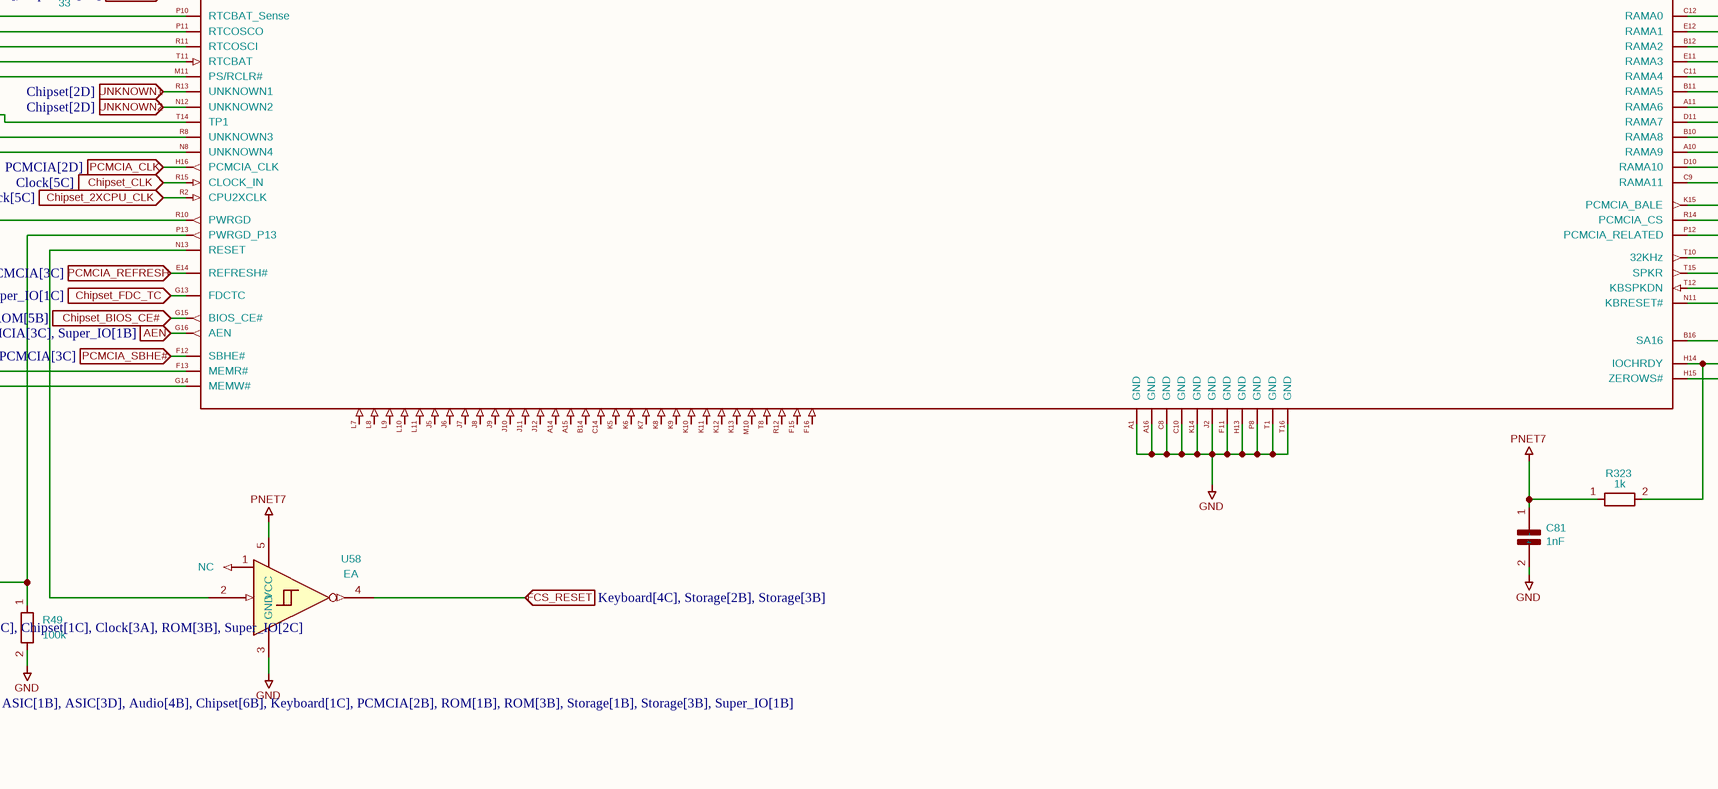
[diagram p18: Chipset.SchDoc, bottom middle]
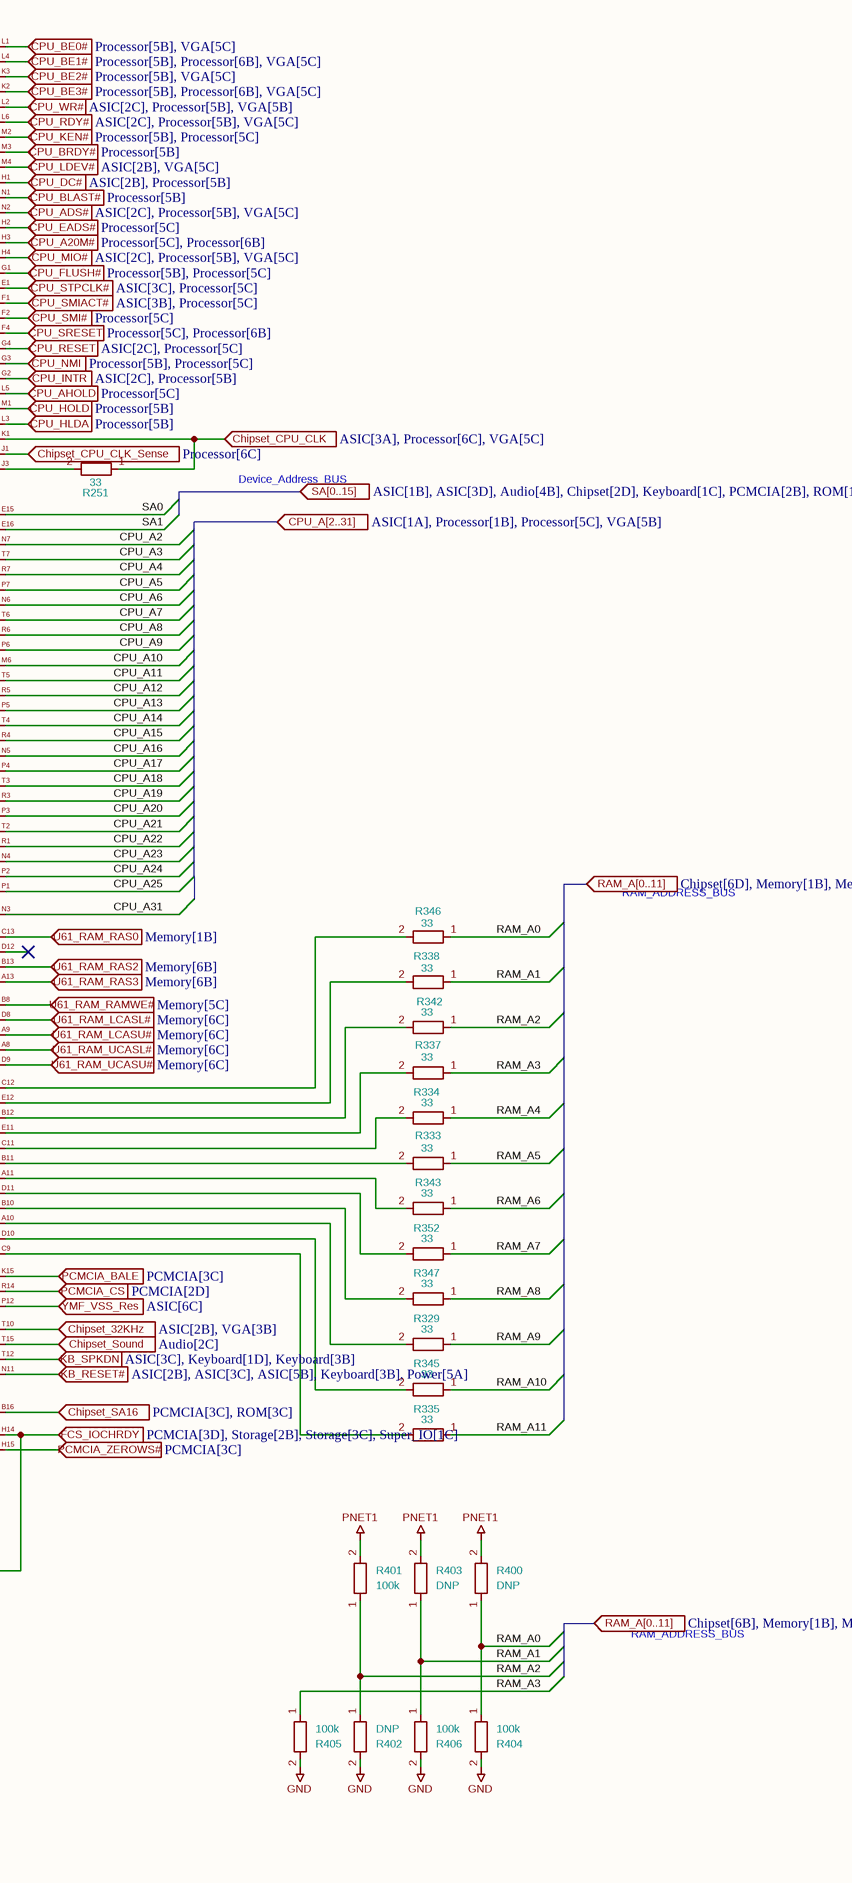
[diagram p19: Chipset.SchDoc, bottom right]

### Parts
C8  150nF  [C_0402_1005Metric]
C35  150nF  [C_0402_1005Metric]
C69  1nF  [C_0402_1005Metric]
C70  100nF  [C_0402_1005Metric]
C73  120nF  [C_0402_1005Metric]
C75  100nF  [C_0402_1005Metric]
C76  100nF  [C_0402_1005Metric]
C77  1nF  [C_0402_1005Metric]
C79  1uF  [C_0603_1608Metric]
C80  1uF  [C_0603_1608Metric]
C81  1nF  [C_0402_1005Metric]
C82  100nF  [C_0402_1005Metric]
C250  18pF  [C_0402_1005Metric]
C251  18pF  [C_0402_1005Metric]
C252  1nF  [C_0402_1005Metric]
C253  150nF  [C_0402_1005Metric]
D21  3D  [3D]
D23  92  [D_0603_1608Metric]
D58  K  [SOT-416L]
J4  connector-4  [connector-4]
J14  TestPoint_Pad_D1.5mm  [TestPoint_Pad_D1.5mm]
R31  300  [R_0402_1005Metric]
R49  100k  [R_0402_1005Metric]
R57  100k  [R_0402_1005Metric]
R96  47k  [R_0402_1005Metric]
R116  100k  [R_0402_1005Metric]
R246  47k  [R_0402_1005Metric]
R248  470k  [R_0402_1005Metric]
R249  47k  [R_0402_1005Metric]
R251  33  [R_0402_1005Metric]
R308  10  [R_0402_1005Metric]
R318  33  [R_0402_1005Metric]
R322  33  [R_0402_1005Metric]
R323  1k  [R_0402_1005Metric]
R324  33  [R_0402_1005Metric]
R326  33  [R_0402_1005Metric]
R329  33  [R_0402_1005Metric]
R333  33  [R_0402_1005Metric]
R334  33  [R_0402_1005Metric]
R335  33  [R_0402_1005Metric]
R337  33  [R_0402_1005Metric]
R338  33  [R_0402_1005Metric]
R342  33  [R_0402_1005Metric]
R343  33  [R_0402_1005Metric]
R345  33  [R_0402_1005Metric]
R346  33  [R_0402_1005Metric]
R347  33  [R_0402_1005Metric]
R352  33  [R_0402_1005Metric]
R400  DNP  [R_0402_1005Metric]
R401  100k  [R_0402_1005Metric]
R402  DNP  [R_0402_1005Metric]
R403  DNP  [R_0402_1005Metric]
R404  100k  [R_0402_1005Metric]
R405  100k  [R_0402_1005Metric]
R406  100k  [R_0402_1005Metric]
U7  HD151015  [TSSOP-24_6.1x7.8mm_P0.65mm]
U19  7W126  [sso-8]  (parts A,B,C of 3)
U58  EA  [SOT-353]
U61  VL82C420  [BGA-256]
X3  32768  [XTAL-3]

### Ports
AEN (in, see ASIC[2B], ASIC[3D], Keyboard[3C], PCMCIA[3C], Super_IO[1B]), Bowman1 (in, see ASIC[2A]), Bowman2 (in, see ASIC[2A]), Bowman3 (in, see ASIC[3A]), Bowman4 (in, see ASIC[2A]), Bowman5 (in, see ASIC[2A], Chipset[2C]), Bowman5 (in, see ASIC[2A], Chipset[2D]), Bowman5_Buff (in, see ROM[6B]), Chipset_2XCPU_CLK (in, see Clock[5C]), Chipset_32KHz (in, see ASIC[2B], VGA[3B]), Chipset_BIOS_CE# (in, see ROM[5B]), Chipset_CLK (in, see Clock[5C]), Chipset_CPU_CLK (in, see ASIC[3A], Processor[6C], VGA[5C]), Chipset_CPU_CLK_Sense (in, see Processor[6C]), Chipset_FDC_TC (in, see Super_IO[1C]), Chipset_SA16 (in, see PCMCIA[3C], ROM[3C]), Chipset_Sound (in, see Audio[2C]), CMOS_BATT_Sense (in, see Power[5C]), CPU_A20M# (in, see Processor[5C], Processor[6B]), CPU_A[2..31] (in, see ASIC[1A], Processor[1B], Processor[5C], VGA[5B]), CPU_ADS# (in, see ASIC[2C], Processor[5B], VGA[5C]), CPU_AHOLD (in, see Processor[5C]), CPU_BE0# (in, see Processor[5B], VGA[5C]), CPU_BE1# (in, see Processor[5B], Processor[6B], VGA[5C]), CPU_BE2# (in, see Processor[5B], VGA[5C]), CPU_BE3# (in, see Processor[5B], Processor[6B], VGA[5C]), CPU_BLAST# (in, see Processor[5B]), CPU_BRDY# (in, see Processor[5B]), CPU_D[0..31] (in, see Memory[3B], Memory[3C], Processor[1A], VGA[3B]), CPU_DC# (in, see ASIC[2B], Processor[5B]), CPU_EADS# (in, see Processor[5C]), CPU_FLUSH# (in, see Processor[5B], Processor[5C]), CPU_HLDA (in, see Processor[5B]), CPU_HOLD (in, see Processor[5B]), CPU_INTR (in, see ASIC[2C], Processor[5B]), CPU_KEN# (in, see Processor[5B], Processor[5C]), CPU_LDEV# (in, see ASIC[2B], VGA[5C]), CPU_MIO# (in, see ASIC[2C], Processor[5B], VGA[5C]), CPU_NMI (in, see Processor[5B], Processor[5C]), CPU_RDY# (in, see ASIC[2C], Processor[5B], VGA[5C]), CPU_RESET (in, see ASIC[2C], Processor[5C]), CPU_SMI# (in, see Processor[5C]), CPU_SMIACT# (in, see ASIC[3B], Processor[5C]), CPU_SRESET (in, see Processor[5C], Processor[6B]), CPU_STPCLK# (in, see ASIC[3C], Processor[5C]), CPU_WR# (in, see ASIC[2C], Processor[5B], VGA[5B]), Enable_IRDA_Buf (in, see DockStation[2C]), FCS_IOCHRDY (in, see PCMCIA[3D], Storage[2B], Storage[3C], Super_IO[1C]), FCS_RESET (in, see Keyboard[4C], Storage[2B], Storage[3B]), IOCS16# (in, see PCMCIA[3C], Storage[2B], Storage[4B], Super_IO[4C]), IOR# (in, see ASIC[2B], ASIC[3D], Audio[3C], Audio[4C], Keyboard[2C], Keyboard[4C], PCMCIA[3C], Storage[2C], Super_IO[1B]), IOW# (in, see ASIC[2B], ASIC[3D], Keyboard[2C], Keyboard[4C], PCMCIA[3C], Storage[2C], Super_IO[2A]), KB_RESET# (in, see ASIC[2B], ASIC[3C], ASIC[5B], Keyboard[3B], Power[5A]), KB_SCLK# (in, see Keyboard[2C]), KB_SCLK_shift (in, see Keyboard[2D]), KB_SPKDN (in, see ASIC[3C], Keyboard[1D], Keyboard[3B]), KB_SRDY# (in, see Keyboard[2C]), KB_SRDY#_shift (in, see DockStation[2A]), LA17 (in, see PCMCIA[3C]), LA18 (in, see PCMCIA[3C]), LA19 (in, see PCMCIA[3C]), LA20 (in, see PCMCIA[3C]), LA21 (in, see PCMCIA[3C]), LA22 (in, see PCMCIA[3C]), LA23 (in, see PCMCIA[3C]), MEMCS16# (in, see ASIC[2B], PCMCIA[2C]), MEMR# (in, see PCMCIA[3C], ROM[2C], ROM[5B]), MEMW# (in, see PCMCIA[3C], ROM[6B]), MIC_J17 (in, see Audio[3C]), PCMCIA_BALE (in, see PCMCIA[3C]), PCMCIA_CLK (in, see PCMCIA[2D]), PCMCIA_CS (in, see PCMCIA[2D]), PCMCIA_REFRESH (in, see PCMCIA[3C]), PCMCIA_SBHE# (in, see PCMCIA[3C]), PCMCIA_ZEROWS# (in, see PCMCIA[3C]), Pluto_EN_IRDA (in, see ASIC[4C]), PWRGD (in, see ASIC[2B], ASIC[3B], ASIC[3C], Chipset[1C], Clock[3A], ROM[3B], Super_IO[2C]), PWRGD (in, see ASIC[2B], ASIC[3B], ASIC[3C], Chipset[2D], Clock[3A], ROM[3B], Super_IO[2C]), PWRGD_shift (in, see Audio[3C], Power[2C]), RAM_A[0..11] (in, see Chipset[6B], Memory[1B], Memory[1C], Memory[5B]), RAM_A[0..11] (in, see Chipset[6D], Memory[1B], Memory[1C], Memory[5B]), RTCBAT (in, see ASIC[6B]), SA[0..15] (in, see ASIC[1B], ASIC[3D], Audio[4B], Chipset[2D], Keyboard[1C], PCMCIA[2B], ROM[1B], ROM[3B], Storage[1B], Storage[3B], Super_IO[1B]), SA[0..15] (in, see ASIC[1B], ASIC[3D], Audio[4B], Chipset[6B], Keyboard[1C], PCMCIA[2B], ROM[1B], ROM[3B], Storage[1B], Storage[3B], Super_IO[1B]), SD[0..15] (in, see ASIC[1B], ASIC[3C], Audio[3B], Keyboard[1C], PCMCIA[2C], ROM[3B], ROM[5C], Storage[1B], Storage[1C], Storage[3B], Super_IO[1B]), U61_RAM_LCASL# (in, see Memory[6C]), U61_RAM_LCASU# (in, see Memory[6C]), U61_RAM_RAMWE# (in, see Memory[5C]), U61_RAM_RAS0 (in, see Memory[1B]), U61_RAM_RAS2 (in, see Memory[6B]), U61_RAM_RAS3 (in, see Memory[6B]), U61_RAM_UCASL# (in, see Memory[6C]), U61_RAM_UCASU# (in, see Memory[6C]), U61_RTCBAT_470K (in, see Power[2D]), U71_OR1_IN2 (in, see DockStation[5B]), UNKNOWN1 (in, see Chipset[2C]), UNKNOWN1 (in, see Chipset[2D]), UNKNOWN2 (in, see Chipset[2C]), UNKNOWN2 (in, see Chipset[2D]), YMF_SA0_A0 (in, see Audio[3B]), YMF_VSS_Res (in, see ASIC[6C])

### Nets
GND: C8.2 C35.1 C69.2 C70.1 C73.1(+) C75.2(-) C76.2 C77.1(+) C79.2 C80.2 C81.2(-) C82.2 C250.1 C251.1 C252.2 C253.2 D23.2(A) J4.2(Pin_2) R49.2 R57.2 R402.2 R404.2 R405.2 R406.2 U7.12(GND) U7.13(GND) U7.23(G#) U19.4(GND) U19.5 U19.7 U58.3(GND) U61.A1(GND) U61.A16(GND) U61.C8(GND) U61.C10(GND) U61.F11(GND) U61.H13(GND) U61.J2(GND) U61.K14(GND) U61.P8(GND) U61.T1(GND) U61.T16(GND)
PNET1: C69.1 C73.2(-) C75.1(+) C77.2(-) C252.1 C253.1 R96.1 R246.1 R249.1 R400.2 R401.2 R403.2 U7.1(VCCA) U7.2(DIR) U19.1 U61.A12(VCC) U61.B2(VCC) U61.B9(VCC) U61.B15(VCC) U61.J4(VCC) U61.K4(VCC) U61.M5(VCC)
PNET5: C35.2 U7.24(VCCB)
PNET7: C76.1 C81.1(+) R323.1 U58.5(VCC) U61.F14(VCCIO) U61.M14(VCCIO)
VCC: D58.2(A)
AEN: U61.G16(AEN) ; port AEN
Bowman1: U61.N9(Bowman1) ; port Bowman1
Bowman2: U61.P9(Bowman2) ; port Bowman2
Bowman3: U61.R9(Bowman3) ; port Bowman3
Bowman4: U61.T9(Bowman4) ; port Bowman4
Bowman5: R57.1 U7.3(A0) U61.T13(Bowman5) ; port Bowman5
Bowman5_Buff: U7.22(B0) ; port Bowman5_Buff
Chipset_2XCPU_CLK: U61.R2(CPU2XCLK) ; port Chipset_2XCPU_CLK
Chipset_32KHz: U61.T10(32KHz) ; port Chipset_32KHz
Chipset_BIOS_CE#: U61.G15(BIOS_CE#) ; port Chipset_BIOS_CE#
Chipset_CLK: U61.R15(CLOCK_IN) ; port Chipset_CLK
Chipset_CPU_CLK: R251.1 U61.K1(CPUCLK) ; port Chipset_CPU_CLK
Chipset_CPU_CLK_Sense: U61.J1(CPUCLKSENS) ; port Chipset_CPU_CLK_Sense
Chipset_FDC_TC: U61.G13(FDCTC) ; port Chipset_FDC_TC
Chipset_SA16: U61.B16(SA16) ; port Chipset_SA16
Chipset_Sound: U61.T15(SPKR) ; port Chipset_Sound
CMOS_BATT+: C8.1 J4.3(Pin_3) R31.2
CMOS_BATT_Sense: J4.4(Pin_4) ; port CMOS_BATT_Sense
CPU_A2: U61.N7(CPUA2)
CPU_A3: U61.T7(CPUA3)
CPU_A4: U61.R7(CPUA4)
CPU_A5: U61.P7(CPUA5)
CPU_A6: U61.N6(CPUA6)
CPU_A7: U61.T6(CPUA7)
CPU_A8: U61.R6(CPUA8)
CPU_A9: U61.P6(CPUA9)
CPU_A10: U61.M6(CPUA10)
CPU_A11: U61.T5(CPUA11)
CPU_A12: U61.R5(CPUA12)
CPU_A13: U61.P5(CPUA13)
CPU_A14: U61.T4(CPUA14)
CPU_A15: U61.R4(CPUA15)
CPU_A16: U61.N5(CPUA16)
CPU_A17: U61.P4(CPUA17)
CPU_A18: U61.T3(CPUA18)
CPU_A19: U61.R3(CPUA19)
CPU_A20: U61.P3(CPUA20)
CPU_A20M#: U61.H3(CPUA20M#) ; port CPU_A20M#
CPU_A21: U61.T2(CPUA21)
CPU_A22: U61.R1(CPUA22)
CPU_A23: U61.N4(CPUA23)
CPU_A24: U61.P2(CPUA24)
CPU_A25: U61.P1(CPUA25)
CPU_A31: U61.N3(CPUA31)
CPU_ADS#: U61.N2(CPUADS#) ; port CPU_ADS#
CPU_AHOLD: U61.L5(CPUAHOLD) ; port CPU_AHOLD
CPU_BE0#: U61.L1(CPUBE0#) ; port CPU_BE0#
CPU_BE1#: U61.L4(CPUBE1#) ; port CPU_BE1#
CPU_BE2#: U61.K3(CPUBE2#) ; port CPU_BE2#
CPU_BE3#: U61.K2(CPUBE3#) ; port CPU_BE3#
CPU_BLAST#: U61.N1(CPUBLAST#) ; port CPU_BLAST#
CPU_BRDY#: U61.M3(CPUBRDY#) ; port CPU_BRDY#
CPU_D0: U61.E2(D0)
CPU_D1: U61.E5(D1)
CPU_D2: U61.E3(D2)
CPU_D3: U61.D1(D3)
CPU_D4: U61.D2(D4)
CPU_D5: U61.E4(D5)
CPU_D6: U61.D3(D6)
CPU_D7: U61.C1(D7)
CPU_D8: U61.C2(D8)
CPU_D9: U61.C3(D9)
CPU_D10: U61.B1(D10)
CPU_D11: U61.A2(D11)
CPU_D12: U61.D4(D12)
CPU_D13: U61.B3(D13)
CPU_D14: U61.A3(D14)
CPU_D15: U61.C4(D15)
CPU_D16: U61.D5(D16)
CPU_D17: U61.B4(D17)
CPU_D18: U61.A4(D18)
CPU_D19: U61.C5(D19)
CPU_D20: U61.F6(D20)
CPU_D21: U61.B5(D21)
CPU_D22: U61.A5(D22)
CPU_D23: U61.E6(D23)
CPU_D24: U61.C6(D24)
CPU_D25: U61.B6(D25)
CPU_D26: U61.A6(D26)
CPU_D27: U61.D6(D27)
CPU_D28: U61.C7(D28)
CPU_D29: U61.B7(D29)
CPU_D30: U61.A7(D30)
CPU_D31: U61.D7(D31)
CPU_DC#: U61.H1(CPUDC#) ; port CPU_DC#
CPU_EADS#: U61.H2(CPUEADS#) ; port CPU_EADS#
CPU_FLUSH#: U61.G1(CPUFLUSH#) ; port CPU_FLUSH#
CPU_HLDA: U61.L3(CPUHLDA) ; port CPU_HLDA
CPU_HOLD: U61.M1(CPUHOLD) ; port CPU_HOLD
CPU_INTR: U61.G2(CPUINTR) ; port CPU_INTR
CPU_KEN#: U61.M2(CPUKEN#) ; port CPU_KEN#
CPU_LDEV#: U61.M4(CPULDEV#) ; port CPU_LDEV#
CPU_MIO#: U61.H4(CPUMIO#) ; port CPU_MIO#
CPU_NMI: U61.G3(CPUNMI) ; port CPU_NMI
CPU_RDY#: U61.L6(CPURDY#) ; port CPU_RDY#
CPU_RESET: U61.G4(CPURESET) ; port CPU_RESET
CPU_SMI#: U61.F2(CPUSMI#) ; port CPU_SMI#
CPU_SMIACT#: U61.F1(CPUSMIACT#) ; port CPU_SMIACT#
CPU_SRESET: U61.F4(CPUSRESET#) ; port CPU_SRESET
CPU_STPCLK#: U61.E1(CPUSTPCLK#) ; port CPU_STPCLK#
CPU_WR#: U61.L2(CPUWR#) ; port CPU_WR#
Enable_IRDA_Buf: U7.15(B7) ; port Enable_IRDA_Buf
FCS_IOCHRDY: R323.2 U61.H14(IOCHRDY) ; port FCS_IOCHRDY
FCS_RESET: U58.4 ; port FCS_RESET
IOCS16#: U61.J16(IOCS16#) ; port IOCS16#
IOR#: R326.2 ; port IOR#
IOW#: R318.1 ; port IOW#
KB_RESET#: U61.N11(KBRESET#) ; port KB_RESET#
KB_SCLK#: U7.8(A5) ; port KB_SCLK#
KB_SCLK_shift: U7.17(B5) ; port KB_SCLK_shift
KB_SPKDN: U61.T12(KBSPKDN) ; port KB_SPKDN
KB_SRDY#: U7.7(A4) ; port KB_SRDY#
KB_SRDY#_shift: U7.18(B4) ; port KB_SRDY#_shift
LA17: U61.D13(LA17) ; port LA17
LA18: U61.C15(LA18) ; port LA18
LA19: U61.C16(LA19) ; port LA19
LA20: U61.D14(LA20) ; port LA20
LA21: U61.E13(LA21) ; port LA21
LA22: U61.D15(LA22) ; port LA22
LA23: U61.D16(LA23) ; port LA23
MEMCS16#: U61.J13(MEMCS16#) ; port MEMCS16#
MEMR#: R322.1 ; port MEMR#
MEMW#: R324.1 ; port MEMW#
MIC_J17: J4.1(Pin_1) ; port MIC_J17
PCMCIA_BALE: U61.K15(PCMCIA_BALE) ; port PCMCIA_BALE
PCMCIA_CLK: U61.H16(PCMCIA_CLK) ; port PCMCIA_CLK
PCMCIA_CS: U61.R14(PCMCIA_CS) ; port PCMCIA_CS
PCMCIA_REFRESH: U61.E14(REFRESH#) ; port PCMCIA_REFRESH
PCMCIA_SBHE#: U61.F12(SBHE#) ; port PCMCIA_SBHE#
PCMCIA_ZEROWS#: U61.H15(ZEROWS#) ; port PCMCIA_ZEROWS#
Pluto_EN_IRDA: U7.10(A7) ; port Pluto_EN_IRDA
PWRGD: U7.9(A6) U19.6 ; port PWRGD
PWRGD_shift: U7.16(B6) ; port PWRGD_shift
RAM_A0: R346.1 R400.1 R404.1
RAM_A1: R338.1 R403.1 R406.1
RAM_A2: R342.1 R401.1 R402.1
RAM_A3: R337.1 R405.1
RAM_A4: R334.1
RAM_A5: R333.1
RAM_A6: R343.1
RAM_A7: R352.1
RAM_A8: R347.1
RAM_A9: R329.1
RAM_A10: R345.1
RAM_A11: R335.1
RTCBAT: C70.2 C80.1 C82.1 D21.2(K) R116.2 R248.2 U19.8(VCC) U61.T11(RTCBAT) ; port RTCBAT
SA0: U7.11(A8) U61.E15(SA0)
SA1: U61.E16(SA1)
SD0: U61.L13(SD0)
SD1: U61.L16(SD1)
SD2: U61.L15(SD2)
SD3: U61.L14(SD3)
SD4: U61.L12(SD4)
SD5: U61.M16(SD5)
SD6: U61.M15(SD6)
SD7: U61.M12(SD7)
SD8: U61.N16(SD8)
SD9: U61.N15(SD9)
SD10: U61.M13(SD10)
SD11: U61.N14(SD11)
SD12: U61.P16(SD12)
SD13: U61.P15(SD13)
SD14: U61.P14(SD14)
SD15: U61.R16(SD15)
U61_RAM_LCASL#: U61.D8(LCASL#) ; port U61_RAM_LCASL#
U61_RAM_LCASU#: U61.A9(LCASU#) ; port U61_RAM_LCASU#
U61_RAM_RAMWE#: U61.B8(RAMWE#) ; port U61_RAM_RAMWE#
U61_RAM_RAS0: U61.C13(RAS0) ; port U61_RAM_RAS0
U61_RAM_RAS2: U61.B13(RAS2) ; port U61_RAM_RAS2
U61_RAM_RAS3: U61.A13(RAS3) ; port U61_RAM_RAS3
U61_RAM_UCASL#: U61.A8(UCASL#) ; port U61_RAM_UCASL#
U61_RAM_UCASU#: U61.D9(UCASU#) ; port U61_RAM_UCASU#
U61_RTCBAT_470K: R248.1 U61.P10(RTCBAT_Sense) ; port U61_RTCBAT_470K
U71_OR1_IN2: U7.19(B3) ; port U71_OR1_IN2
UNKNOWN1: U7.4(A1) U61.R13(UNKNOWN1) ; port UNKNOWN1
UNKNOWN2: U7.5(A2) U61.N12(UNKNOWN2) ; port UNKNOWN2
YMF_SA0_A0: U7.14(B8) ; port YMF_SA0_A0
YMF_VSS_Res: U61.P12(PCMCIA_RELATED) ; port YMF_VSS_Res
NetC79_1: C79.1 R116.1 U61.M11(PS/RCLR#)
NetC250_2: C250.2 U61.P11(RTCOSCO) X3.4
NetC251_2: C251.2 U61.R11(RTCOSCI) X3.1
NetD21_1: D21.1(A) D23.1(K) R308.1
NetD21_3: D21.3(A) R31.1
NetD58_1: D58.1(K) R308.2
NetJ14_1: J14.1 U61.T14(TP1)
NetR49_1: R49.1 U7.6(A3) U61.P13(PWRGD_P13)
NetR96_2: R96.2 U19.2 U61.R10(PWRGD)
NetR246_2: R246.2 U61.R8(UNKNOWN3)
NetR249_2: R249.2 U61.N8(UNKNOWN4)
NetR251_2: R251.2 U61.J3(CPUCLK33)
NetR318_2: R318.2 U61.J14(IOW#)
NetR322_2: R322.2 U61.F13(MEMR#)
NetR324_2: R324.2 U61.G14(MEMW#)
NetR326_1: R326.1 U61.J15(IOR#)
NetR329_2: R329.2 U61.A10(RAMA9)
NetR333_2: R333.2 U61.B11(RAMA5)
NetR334_2: R334.2 U61.C11(RAMA4)
NetR335_2: R335.2 U61.C9(RAMA11)
NetR337_2: R337.2 U61.E11(RAMA3)
NetR338_2: R338.2 U61.E12(RAMA1)
NetR342_2: R342.2 U61.B12(RAMA2)
NetR343_2: R343.2 U61.A11(RAMA6)
NetR345_2: R345.2 U61.D10(RAMA10)
NetR346_2: R346.2 U61.C12(RAMA0)
NetR347_2: R347.2 U61.B10(RAMA8)
NetR352_2: R352.2 U61.D11(RAMA7)
NetU58_2: U58.2 U61.N13(RESET)

Not connected (* = marked no-connect by the designer): D58 3(common)*; U7 20(B2)* 21(B1)*; U19 3*; U58 1(NC); U61 A14 A15 B14 C14 D12(RAS1)* E7 E8 E9 E10 F3 F5 F7 F8 F9 F10 F15 F16 G5 G6 G7 G8 G9 G10 G11 G12 H5 H6 H7 H8 H9 H10 H11 H12 J5 J6 J7 J8 J9 J10 J11 J12 K5 K6 K7 K8 K9 K10 K11 K12 K13 K16 L7 L8 L9 L10 L11 M7 M8 M9 M10 N10 R12 T8; X3 2* 3*

### Notes on the sheet
- CPU_DATA_BUS
- Device_Address_BUS
- Device_Data_BUS
- RAM_ADDRESS_BUS
- 1
- 2
- 3
- 4
- 5
- 6
- 7
- 8
- 9
- 10
- 11
- A
- B
- C
- D
- E
- F
- G
- H
- Title: PC110
- File: Chipset.kicad_sch
- Sheet: /
- Recreated by: Ahmad Byagowi
- KiCad E.D.A.  kicad (5.1.4)-1
- Size: A2
- Date:
- Rev:
- Id: 1/1
- (in symbol VL82C420) VL82C420FC5\nBGA256

### Library data of the parts
C8 C35 C69 C70 C73 C75-C77 C79-C82 C250-C253 = C
  C8 C35 C253: Value: 150nF; Footprint: Capacitor_SMD:C_0402_1005Metric
  C69 C77 C81 C252: Value: 1nF; Footprint: Capacitor_SMD:C_0402_1005Metric
  C70 C75 C76 C82: Value: 100nF; Footprint: Capacitor_SMD:C_0402_1005Metric
  C73: Value: 120nF; Footprint: Capacitor_SMD:C_0402_1005Metric
  C79 C80: Value: 1uF; Footprint: Capacitor_SMD:C_0603_1608Metric
  C250 C251: Value: 18pF; Footprint: Capacitor_SMD:C_0402_1005Metric
D21 = D_Schottky_Dual_CommonCathode_AKA: Value: 3D; Footprint: PC110:3D
D23 = D: Value: 92; Footprint: Diode_SMD:D_0603_1608Metric
D58 = D_Dual_Series_KAC: Value: K; Footprint: PC110:SOT-416L
J4 = Conn_01x04: Value: connector-4; Footprint: PC110:connector-4
J14 = Debug1: Value: TestPoint_Pad_D1.5mm; Footprint: TestPoint:TestPoint_Pad_D1.5mm
R31 R49 R57 R96 R116 R246 R248 R249 R251 R308 R318 R322-R324 R326 R329 R333-R335 R337 R338 R342 R343 R345-R347 R352 R400-R406 = R
  R31: Value: 300; Footprint: PCM_Resistor_SMD_AKL:R_0402_1005Metric
  R49 R57 R116 R401 R404-R406: Value: 100k; Footprint: PCM_Resistor_SMD_AKL:R_0402_1005Metric
  R96: Value: 47k; Footprint: PCM_Resistor_SMD_AKL:R_0402_1005Metric
  R246 R249: Value: 47k; Footprint: Resistor_SMD:R_0402_1005Metric
  R248: Value: 470k; Footprint: Resistor_SMD:R_0402_1005Metric
  R251: Value: 33; Footprint: Resistor_SMD:R_0402_1005Metric
  R308: Value: 10; Footprint: Resistor_SMD:R_0402_1005Metric
  R318 R322 R324 R326 R329 R333-R335 R337 R338 R342 R343 R345-R347 R352: Value: 33; Footprint: PCM_Resistor_SMD_AKL:R_0402_1005Metric
  R323: Value: 1k; Footprint: PCM_Resistor_SMD_AKL:R_0402_1005Metric
  R400 R402 R403: Value: DNP; Footprint: PCM_Resistor_SMD_AKL:R_0402_1005Metric
U19 = 74AUC2G126: Value: 7W126; Footprint: PC110:sso-8
U58 = 74AHC1G14: Value: EA; Footprint: PC110:SOT-353
X3 = Crystal_GND23: Value: 32768; Footprint: PC110:XTAL-3
U7 = HD151015: Value: HD151015; Footprint: Package_SO:TSSOP-24_6.1x7.8mm_P0.65mm
U61 = VL82C420: Value: VL82C420; Footprint: PC110:BGA-256